# EAGLE board stm32 v0.9 (EAGLE 9.6.2), part 1 of 2
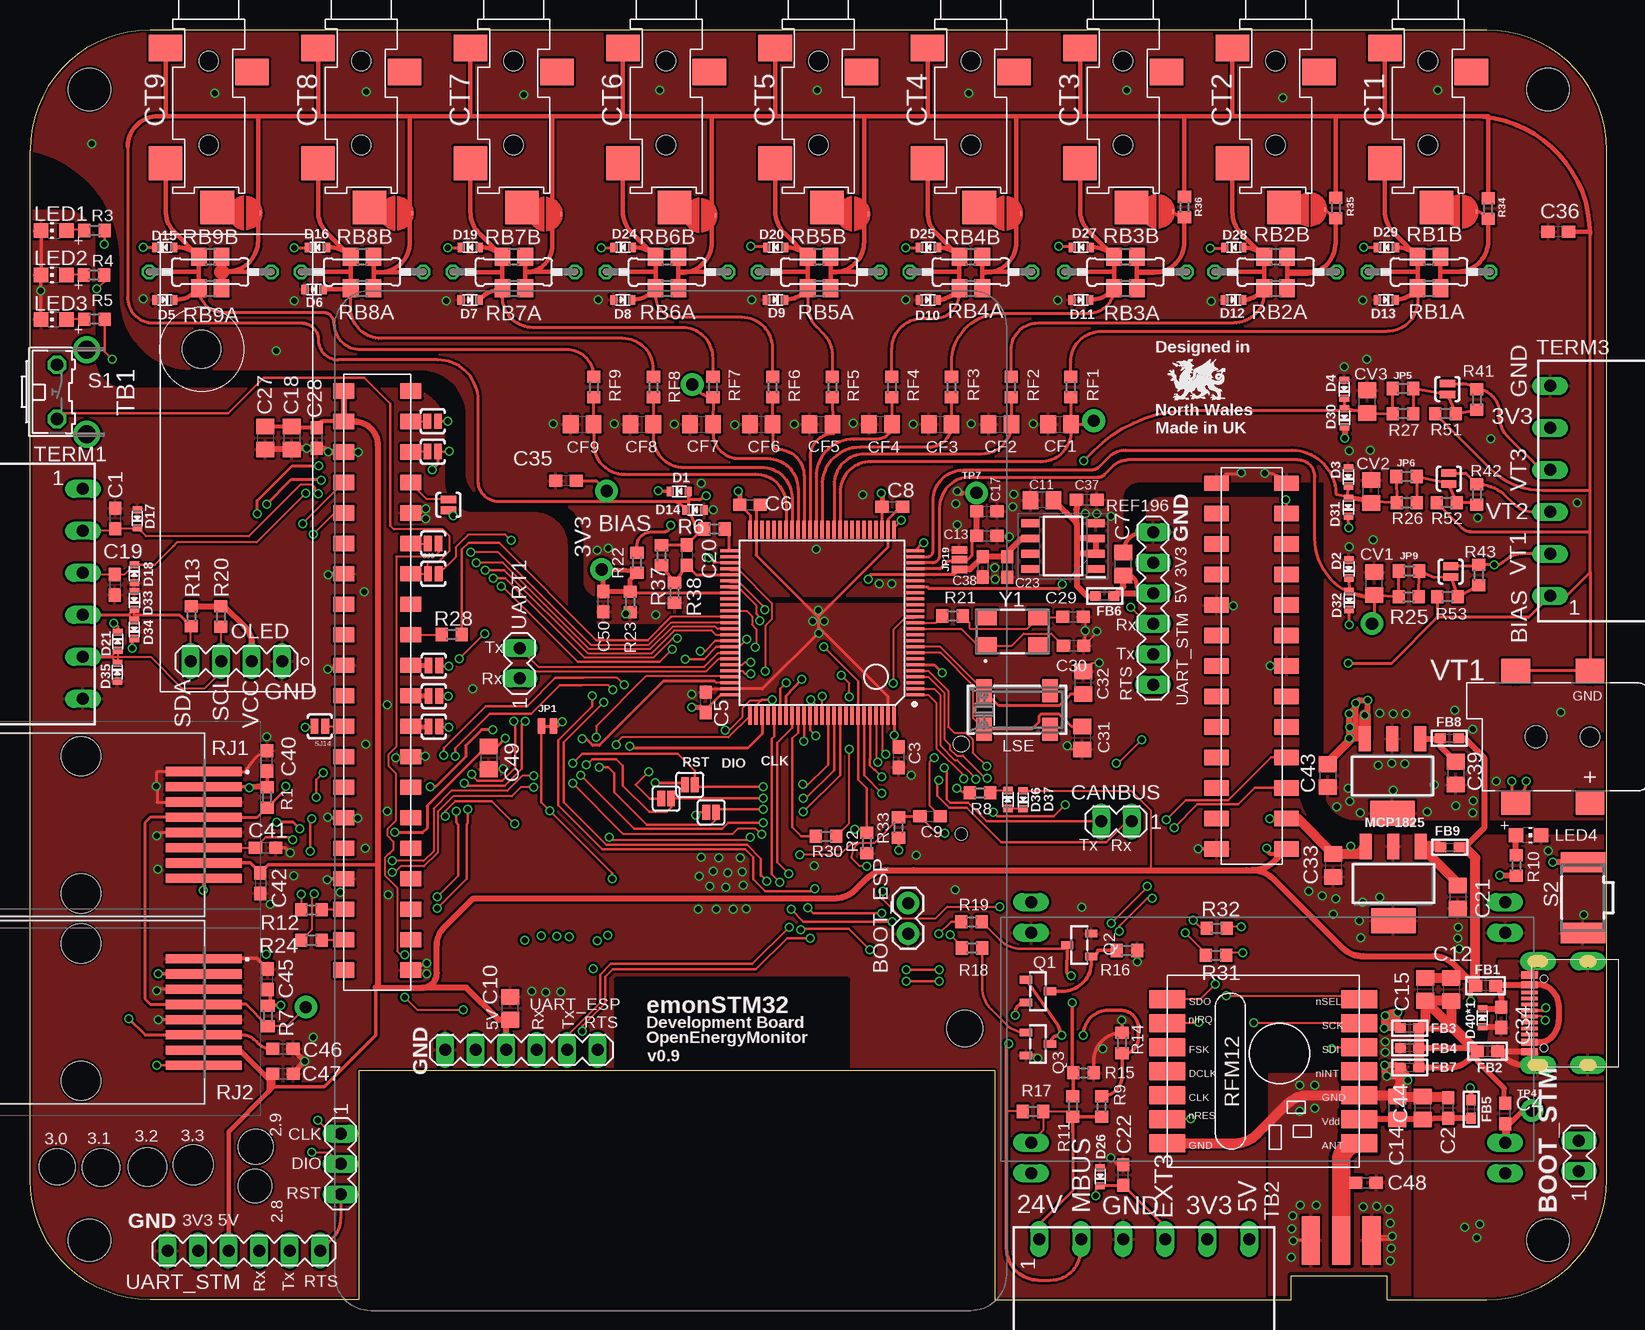
[diagram p5: board, top side]
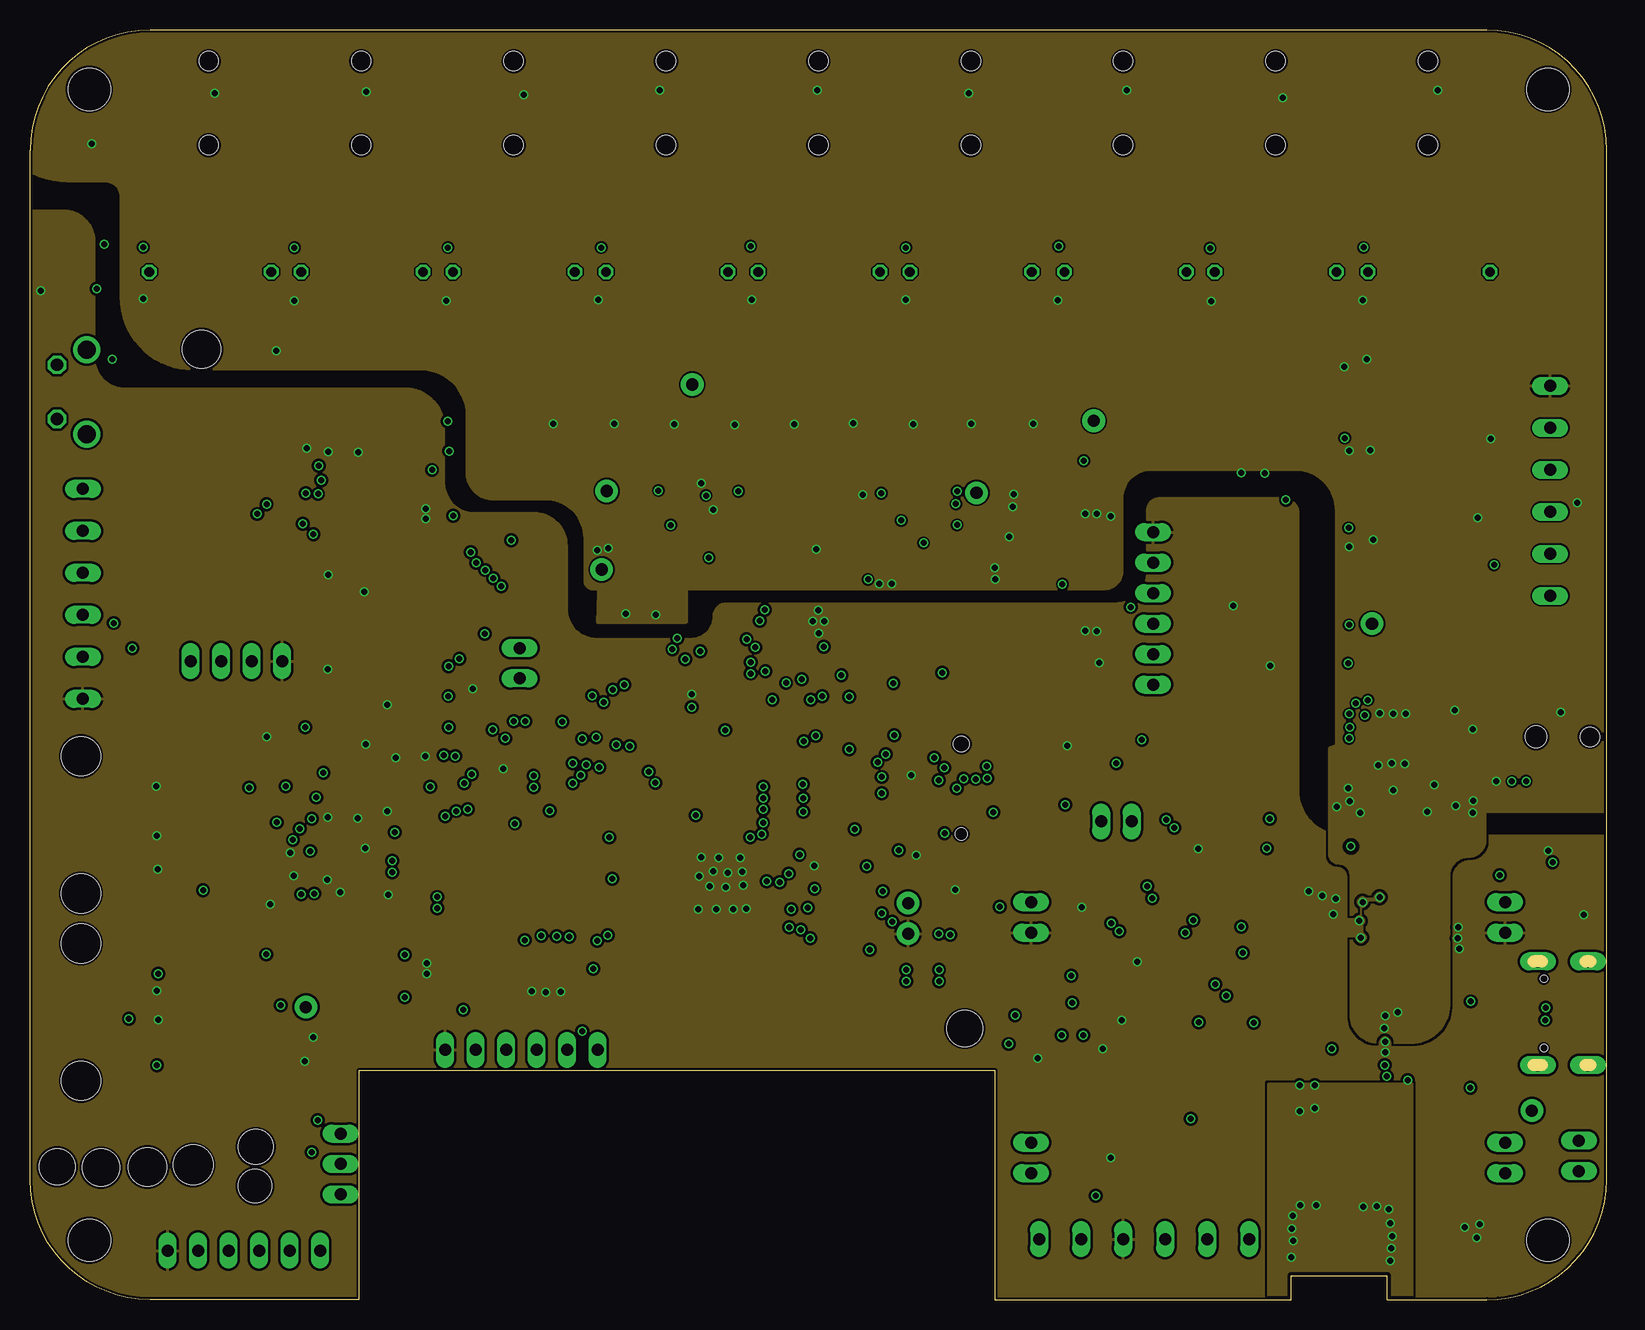
[diagram p6: board, inner layer GND]
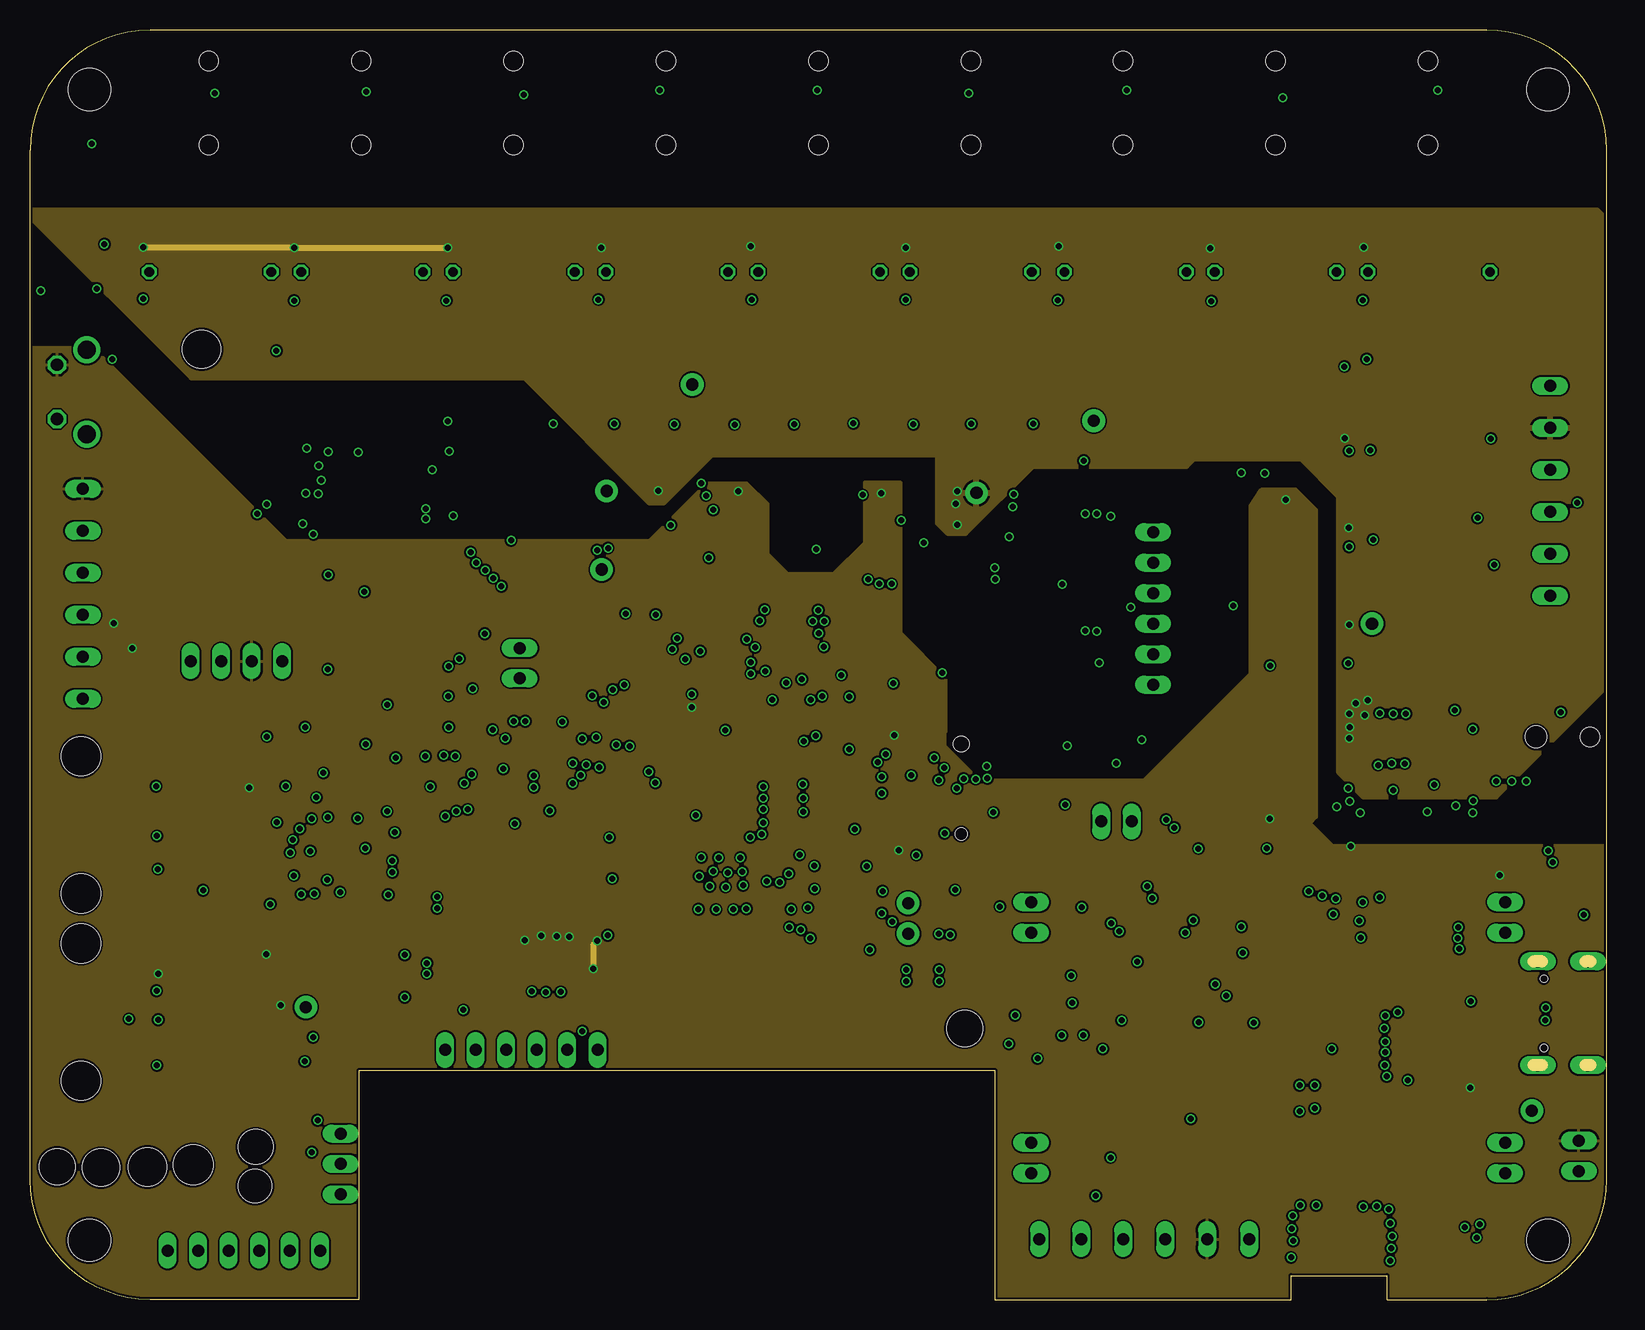
[diagram p7: board, inner layer +3V3]
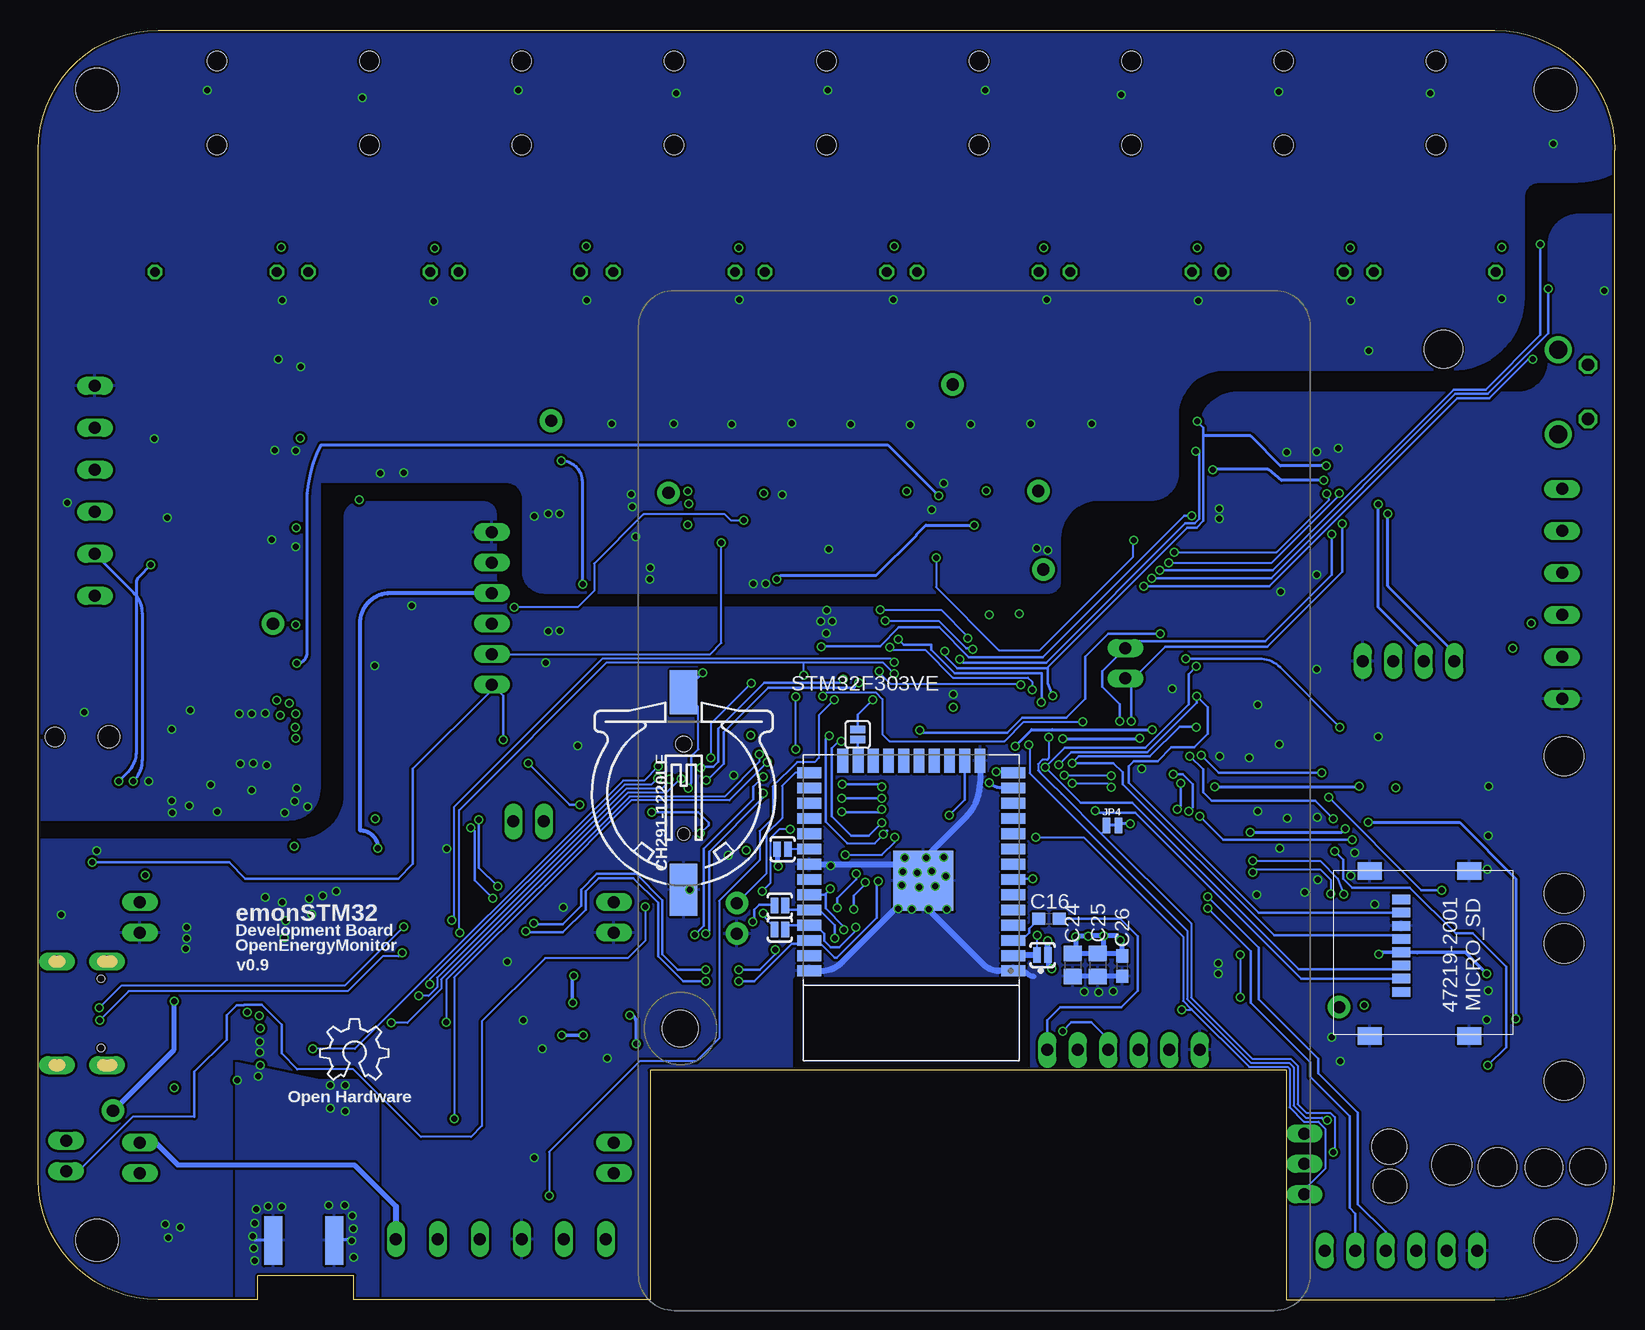
[diagram p8: board, bottom side, seen from below]

Size 131.4 x 105.8 mm. Coordinates in mm from the lower left corner, seen from the top.
Outline: 131.4,10 131.4,95.8 arc90 121.4,105.8 10,105.8 arc90 0,95.8 0,10 arc90 10,0 27.4,0 27.4,19.1 80.4,19.1 80.4,0 105.1,0 105.1,2 113.1,2 113.1,0 121.4,0 arc90 131.4,10
Copper layers (1+2*15+16): Top 0.035mm / dielectric 0.2mm / GND 0.018mm / dielectric 1.1mm / +3V3 0.018mm / dielectric 0.2mm / Bottom 0.035mm
Design rules "ragworm *": minimum track width 7mil, minimum drill 0.5mm, track to track 6mil, track to pad 6mil, pad to pad 7mil, via to via 8mil, smd to smd 0mil, copper to edge 8mil, drill to drill 10mil, minimum pad ring 3mil, minimum via ring 3mil, stop-mask expansion 2mil, vias tented up to drill 25mil, thermal gap 8mil
Net classes: 0 default: width 0.178 mm, drill 0.5 mm, clearance 0.152 mm; 1 power: width 0.254 mm, drill 0.5 mm, clearance 0.152 mm; 2 gnd: width 0.254 mm, drill 0.5 mm, clearance 0.152 mm; 3 ant: width 0.406 mm, drill 0.5 mm, clearance 0.254 mm; 4 cts_vts: width 0.254 mm, drill 0.5 mm, clearance 0.229 mm
Holes 3.5 mm at 126.5,100.85 4.95,100.85 4.95,4.95 126.5,4.95
Holes 3.18 mm at 14.3,79.2
Holes 3 mm at 2.27,11.06
Holes 3.1 mm at 5.92,11
Holes 3.2 mm at 9.79,11.06
Holes 3.3 mm at 13.6,11.23
Holes 2.9 mm at 18.82,12.72
Holes 2.8 mm at 18.75,9.46
tRestrict: area 48.8,18.3 to 68.2,26.7
bRestrict: area 49,18.3 to 68.3,26.7

## Footprints (pad centres in the part's own frame; a part is rotated, then mirrored left to right if it is on the bottom)
1X02 = drill 1.016 pad 1.88: 1 0,0; 2 2.54,0
MA02-1 = drill 1 long: 1 -2.54,0; 2 0,0
C0603 = smd 1.1 x 1: 1 -0.85,0; 2 0.85,0
C0805 = smd 1.3 x 1.5: 1 -0.95,0; 2 0.95,0
SJ-352X-SMT = smd 2.8 x 2.2: P$1 -3.6,-2.4; P$3 3.6,-4.4 | smd 2.8 x 2.8: P$2 -3.6,-12; P$4 0.7,-15.7 | hole 1.6: 0,-3.5; 0,-10.5
SOD-523 = smd 0.8 x 0.6: A 0,-0.75; K 0,0.75
2X13_SMT = smd 1.27 x 2.032: 1 -15.24,-2.921; 2 -15.24,2.921; 3 -12.7,-2.921; 4 -12.7,2.921; 5 -10.16,-2.921; 6 -10.16,2.921; 7 -7.62,-2.921; 8 -7.62,2.921; 9 -5.08,-2.921; 10 -5.08,2.921; 11 -2.54,-2.921; 12 -2.54,2.921; 13 0,-2.921; 14 0,2.921; 15 2.54,-2.921; 16 2.54,2.921; 17 5.08,-2.921; 18 5.08,2.921; 19 7.62,-2.921; 20 7.62,2.921; 21 10.16,-2.921; 22 10.16,2.921; 23 12.7,-2.921; 24 12.7,2.921; 25 15.24,-2.921; 26 15.24,2.921
0603 = smd 1.1 x 1: 1 -0.85,0; 2 0.85,0
_0603 = smd 0.9 x 0.8: 1 -0.762,0; 2 0.762,0
CH291-1220LF = smd 2.3 x 3.66: + 0,-2.296 | smd 2.3 x 4.3: - 0,14.146 | hole 1.3: 0,2 | hole 1: 0,9.5
SJ_2S-NO = smd 0.635 x 1.27: 1 -0.45,0; 2 0.45,0
SMA-EDGE = smd 1.524 x 4.064: GND@0 0,0; GND@1 5.08,0; SIG 2.54,0 | smd 1.524 x 4.064 bottom: GND@2 0,0; GND@3 5.08,0
SMT-JUMPER_2_NC_TRACE_NO-SILK = smd 0.635 x 1.27: 1 -0.508,0; 2 0.508,0
R0603 = smd 1 x 1.1: 1 -0.85,0; 2 0.85,0
SMT-JUMPER_2_NO_NO-SILK_ROUND = smd 0.152 x 0.305: 1 -1.27,0; 2 1.27,0
SMT-JUMPER_3_NO_NO-SILK = smd 0.635 x 1.27: 1 -0.813,0; 2 0,0; 3 0.813,0
CHIP-LED0805 = smd 1.2 x 1.2: A 0,-1.05; C 0,1.05
CRYSTAL_8X3.8 = smd 1.3 x 1.9: P$1 -2.75,-1.6; P$2 2.75,-1.6; P$3 2.75,1.6; P$4 -2.75,1.6
SOT-223 = smd 1 x 2.1: 1 -2.3,-3.1; 2 0,-3.1; 3 2.3,-3.1 | smd 3.7 x 2.1: 4 0,3.1
MA04-1-OLED = drill 1 long: 1 -3.81,0; 2 -1.27,0; 3 1.27,0; 4 3.81,0
RPI3MIRROR2 = smd 1.27 x 1.778: P$41 8.371,6.351; P$42 8.371,0.763; P$43 10.911,6.351; P$44 10.911,0.763; P$45 13.451,6.351; P$46 13.451,0.763; P$47 15.991,6.351; P$48 15.991,0.763; P$49 18.531,6.351; P$50 18.531,0.763; P$51 21.071,6.351; P$52 21.071,0.763; P$53 23.611,6.351; P$54 23.611,0.763; P$55 26.151,6.351; P$56 26.151,0.763; P$57 28.691,6.351; P$58 28.691,0.763; P$59 31.231,6.351; P$60 31.231,0.763; P$61 33.771,6.351; P$62 33.771,0.763; P$63 36.311,6.351; P$64 36.311,0.763; P$65 38.851,6.351; P$66 38.851,0.763; P$67 41.391,6.351; P$68 41.391,0.763; P$69 43.931,6.351; P$70 43.931,0.763; P$71 46.471,6.351; P$72 46.471,0.763; P$73 49.011,6.351; P$74 49.011,0.763; P$75 51.551,6.351; P$76 51.551,0.763; P$77 54.091,6.351; P$78 54.091,0.763; P$79 56.631,6.351; P$80 56.631,0.763 | hole 3: 61.5,52.505
SOIC127P599X175-8N = smd 1.526 x 0.65: 1 -2.712,1.905; 2 -2.712,0.635; 3 -2.712,-0.635; 4 -2.712,-1.905; 5 2.712,-1.905; 6 2.712,-0.635; 7 2.712,0.635; 8 2.712,1.905
SOT23-R = smd 0.635 x 1.016: 1 -0.95,-1; 2 0.95,-1; 3 0,1
0207/10 = drill 0.813 octagon: 1 -5.08,0; 2 5.08,0
R0805 = smd 1.3 x 1.5: 1 -0.95,0; 2 0.95,0
RFM12 = smd 1.5 x 3: 1 -5,-10; 2 -3,-10; 3 -1,-10; 4 1,-10; 5 3,-10; 6 5,-10; 7 7,-10; 8 7,6; 9 5,6; 10 3,6; 11 1,6; 12 -1,6; 13 -3,6; 14 -5,6
955016889 = smd 0.76 x 6.35: 1 -4.445,8.975; 2 -3.175,8.975; 3 -1.905,8.975; 4 -0.635,8.975; 5 0.635,8.975; 6 1.905,8.975; 7 3.175,8.975; 8 4.445,8.975 | hole 3.25: -5.715,-1.25; 5.715,-1.25
B3F-31XX = drill 1.016 octagon: 1 -2.261,-1.245; 2 2.261,-1.245 | drill 1.499 pad 2.159: 3 -3.505,1.245; 4 3.505,1.245
KSS = smd 1.7 x 3.7: 1 -2.95,0; 2 2.95,0
SMT-JUMPER_2_NO_SILK = smd 0.635 x 1.27: 1 -0.406,0; 2 0.406,0
TQFP100 = smd 0.27 x 1.5: 1 -6,-7.75; 2 -5.5,-7.75; 3 -5,-7.75; 4 -4.5,-7.75; 5 -4,-7.75; 6 -3.5,-7.75; 7 -3,-7.75; 8 -2.5,-7.75; 9 -2,-7.75; 10 -1.5,-7.75; 11 -1,-7.75; 12 -0.5,-7.75; 13 0,-7.75; 14 0.5,-7.75; 15 1,-7.75; 16 1.5,-7.75; 17 2,-7.75; 18 2.5,-7.75; 19 3,-7.75; 20 3.5,-7.75; 21 4,-7.75; 22 4.5,-7.75; 23 5,-7.75; 24 5.5,-7.75; 25 6,-7.75; 51 6,7.75; 52 5.5,7.75; 53 5,7.75; 54 4.5,7.75; 55 4,7.75; 56 3.5,7.75; 57 3,7.75; 58 2.5,7.75; 59 2,7.75; 60 1.5,7.75; 61 1,7.75; 62 0.5,7.75; 63 0,7.75; 64 -0.5,7.75; 65 -1,7.75; 66 -1.5,7.75; 67 -2,7.75; 68 -2.5,7.75; 69 -3,7.75; 70 -3.5,7.75; 71 -4,7.75; 72 -4.5,7.75; 73 -5,7.75; 74 -5.5,7.75; 75 -6,7.75 | smd 1.5 x 0.27: 26 7.75,-6; 27 7.75,-5.5; 28 7.75,-5; 29 7.75,-4.5; 30 7.75,-4; 31 7.75,-3.5; 32 7.75,-3; 33 7.75,-2.5; 34 7.75,-2; 35 7.75,-1.5; 36 7.75,-1; 37 7.75,-0.5; 38 7.75,0; 39 7.75,0.5; 40 7.75,1; 41 7.75,1.5; 42 7.75,2; 43 7.75,2.5; 44 7.75,3; 45 7.75,3.5; 46 7.75,4; 47 7.75,4.5; 48 7.75,5; 49 7.75,5.5; 50 7.75,6; 76 -7.75,6; 77 -7.75,5.5; 78 -7.75,5; 79 -7.75,4.5; 80 -7.75,4; 81 -7.75,3.5; 82 -7.75,3; 83 -7.75,2.5; 84 -7.75,2; 85 -7.75,1.5; 86 -7.75,1; 87 -7.75,0.5; 88 -7.75,0; 89 -7.75,-0.5; 90 -7.75,-1; 91 -7.75,-1.5; 92 -7.75,-2; 93 -7.75,-2.5; 94 -7.75,-3; 95 -7.75,-3.5; 96 -7.75,-4; 97 -7.75,-4.5; 98 -7.75,-5; 99 -7.75,-5.5; 100 -7.75,-6
MA06-1 = drill 1 long: 1 -6.35,0; 2 -3.81,0; 3 -1.27,0; 4 1.27,0; 5 3.81,0; 6 6.35,0
MA03-1 = drill 1 long: 1 -2.54,0; 2 0,0; 3 2.54,0
3.5MM_X6 = drill 1 long: P$1 3,8.75; P$2 3,5.25; P$3 3,1.75; P$4 3,-1.75; P$5 3,-5.25; P$6 3,-8.75
1X01_NO_SILK = drill 1.016 pad 1.88: 1 0,0
MODULE_ESP32-WROOM-32D = smd 2 x 0.9: 1 -8.5,5.26; 2 -8.5,3.99; 3 -8.5,2.72; 4 -8.5,1.45; 5 -8.5,0.18; 6 -8.5,-1.09; 7 -8.5,-2.36; 8 -8.5,-3.63; 9 -8.5,-4.9; 10 -8.5,-6.17; 11 -8.5,-7.44; 12 -8.5,-8.71; 13 -8.5,-9.98; 14 -8.5,-11.25; 25 8.5,-11.25; 26 8.5,-9.98; 27 8.5,-8.71; 28 8.5,-7.44; 29 8.5,-6.17; 30 8.5,-4.9; 31 8.5,-3.63; 32 8.5,-2.36; 33 8.5,-1.09; 34 8.5,0.18; 35 8.5,1.45; 36 8.5,2.72; 37 8.5,3.99; 38 8.5,5.26 | smd 0.9 x 2: 15 -5.715,-12.25; 16 -4.445,-12.25; 17 -3.175,-12.25; 18 -1.905,-12.25; 19 -0.635,-12.25; 20 0.635,-12.25; 21 1.905,-12.25; 22 3.175,-12.25; 23 4.445,-12.25; 24 5.715,-12.25 | smd 5 x 5: 39 -1,-2.24
BOOST = drill 1 long: IN+ 17.5,39.5; IN+1 20.04,39.5; OUT+ 17.5,0; OUT+1 20.04,0; P$1 0,0; P$2 0,39.5; P$3 -2.54,0; P$4 -2.54,39.5
47219-2001_MICROSD = smd 1.45 x 2: P$1 0,0; P$2 13.75,0; P$3 0,8.3; P$4 13.75,8.3 | smd 0.8 x 1.5: PIN1 10.08,2.6; PIN2 8.98,2.6; PIN3 7.88,2.6; PIN4 6.78,2.6; PIN5 5.68,2.6; PIN6 4.58,2.6; PIN7 3.48,2.6; PIN8 2.38,2.6
USB-C = smd 0.6 x 1.4: A1/B12 -3.2,0.7; A4/B9 -2.4,0.7; B1/A12 3.2,0.7; B4/A9 2.4,0.7 | smd 0.3 x 1.4: A5 -1.25,0.7; A6 -0.25,0.7; A7 0.25,0.7; A8 1.25,0.7; B5 1.75,0.7; B6 0.75,0.7; B7 -0.75,0.7; B8 -1.75,0.7 | drill 1 pad 1.2 long: GND1 -4.32,0; GND2 4.33,0; GND3 4.33,-4.18; GND4 -4.32,-4.18 | hole 0.6: -2.89,-0.5; 2.89,-0.5
DCJACK_2MM_SMT = smd 2.4 x 2: GND 0,-5.5; GNDBREAK 6.2,-5.5; PWR1 0,5.5; PWR2 6.2,5.5 | hole 1.6: 0,0 | hole 1.8: 4.5,0
ABMM2 = smd 1.8 x 1.4: 1 -2.2,-1.2; 2 2.2,-1.2; 3 2.2,1.2; 4 -2.2,1.2

## Placement (x,y rotation side)
BOOT_ESP  [1X02]  73.18,30.5 90 top
BOOT_STM  [MA02-1]  129.07,13.25 90 top
C1  100nF  [C0603]  7.12,65.08 90 top
C2  100nF  [C0603]  118.19,15.97 90 top
C3  100nF  [C0603]  72.38,45.2 270 top
C4  100nF  [C0603]  122.93,15.5 90 top
C5  100nF  [C0603]  56.33,49.77 90 top
C6  100nF  [C0603]  60,66.23 0 top
C7  2.2uF  [C0805]  91.12,61.3 90 top
C8  100nF  [C0603]  71.86,66.07 0 top
C9  1uF  [C0603]  75.02,40.27 0 top
C10  2.2uF  [C0805]  40.03,24.27 90 top
C11  22uF  [C0805]  84.33,66.63 180 top
C12  22uF  [C0805]  118.45,25.84 270 top
C13  2.2uF  [C0603]  79.73,63.65 0 top
C14  22uF  [C0805]  113.92,15.97 90 top
C15  2.2uF  [C0805]  116.25,25.85 270 top
C16  100nF  [C0603]  47.17,31.73 180 bottom
C17  100nF  [C0603]  79.74,65.69 0 top
C18  22uF  [C0805]  21.8,71.8 270 top
C19  100nF  [C0603]  7.08,59.57 270 top
C20  2.2uF  [C0603]  54.74,62.04 270 top
C21  22uF  [C0805]  118.98,33.55 270 top
C22  100nF  [C0603]  91.11,10.38 90 top
C23  1uf  [C0603]  81.44,61.06 270 top
C24  2.2uF  [C0805]  45.19,27.88 270 bottom
C25  2.2uF  [C0805]  43.1,27.88 270 bottom
C26  100nF  [C0603]  41.08,27.79 270 bottom
C27  2.2uF  [C0805]  19.6,71.8 270 top
C28  100nF  [C0603]  23.9,71.8 270 top
C29  15pF  [C0603]  86.92,56.91 0 top
C30  15pF  [C0603]  86.97,54.5 0 top
C31  10pF  [C0805]  87.68,46.79 270 top
C32  10pF  [C0805]  87.77,51.41 90 top
C33  22uF  [C0805]  108.61,36.18 270 top
C34  100nF  [C0603]  122.61,23.52 270 top
C35  1uF  [C0603]  44.67,68.25 180 top
C36  1uF  [C0603]  127.36,88.98 180 top
C37  100nF  [C0603]  88.06,66.67 0 top
C38  100nF  [C0603]  79.38,61.06 270 top
C39  22uF  [C0805]  118.81,43.87 270 top
C40  100nF  [C0603]  19.75,44.9 90 top
C41  100nF  [C0603]  19.64,37.67 0 top
C42  100nF  [C0603]  19.2,34.7 270 top
C43  22uF  [C0805]  108.15,43.66 270 top
C44  22uF  [C0805]  116.08,15.97 90 top
C45  100nF  [C0603]  19.8,26.7 90 top
C46  100nF  [C0603]  21.07,20.89 0 top
C47  100nF  [C0603]  21.08,18.84 0 top
C48  100nF  [C0603]  111.32,9.72 0 top
C49  10pF  [C0805]  38.22,45.15 270 top
C50  [C0603]  47.79,58.16 90 top
CANBUS  TX/RX  [MA02-1]  89.26,39.85 180 top
CF1  10nF  [C0805]  85.8,72.95 0 top
CF2  10nF  [C0805]  80.83,72.95 0 top
CF3  10nF  [C0805]  75.86,72.95 0 top
CF4  10nF  [C0805]  70.88,72.95 0 top
CF5  10nF  [C0805]  65.91,72.95 0 top
CF6  10nF  [C0805]  60.94,72.95 0 top
CF7  10nF  [C0805]  55.96,72.95 0 top
CF8  10nF  [C0805]  50.99,72.95 0 top
CF9  10nF  [C0805]  46.02,72.95 0 top
CT1  SJ-3523-SMT  [SJ-352X-SMT]  116.5,106.7 0 top
CT2  SJ-3523-SMT  [SJ-352X-SMT]  103.8,106.7 0 top
CT3  SJ-3523-SMT  [SJ-352X-SMT]  91.1,106.7 0 top
CT4  SJ-3523-SMT  [SJ-352X-SMT]  78.4,106.7 0 top
CT5  SJ-3523-SMT  [SJ-352X-SMT]  65.7,106.7 0 top
CT6  SJ-3523-SMT  [SJ-352X-SMT]  53,106.7 0 top
CT7  SJ-3523-SMT  [SJ-352X-SMT]  40.3,106.7 0 top
CT8  SJ-3523-SMT  [SJ-352X-SMT]  27.6,106.7 0 top
CT9  SJ-3523-SMT  [SJ-352X-SMT]  14.9,106.7 0 top
CV1  10nF  [C0805]  112.03,59.68 90 top
CV2  10nF  [C0805]  111.75,67.34 90 top
CV3  10nF  [C0805]  111.43,74.83 90 top
D1  ESD5Z3.3T1G  [SOD-523]  54.1,67.35 90 top
D2  ESD5Z3.3T1G  [SOD-523]  109.92,60.88 180 top
D3  ESD5Z3.3T1G  [SOD-523]  109.87,68.55 180 top
D4  ESD5Z3.3T1G  [SOD-523]  109.52,75.86 180 top
D5  ESD5Z3.3T1G  [SOD-523]  11.23,83.31 270 top
D6  ESD5Z3.3T1G  [SOD-523]  23.66,84.18 270 top
D7  ESD5Z3.3T1G  [SOD-523]  36.67,83.31 270 top
D8  ESD5Z3.3T1G  [SOD-523]  49.4,83.31 270 top
D9  ESD5Z3.3T1G  [SOD-523]  62.12,83.31 270 top
D10  ESD5Z3.3T1G  [SOD-523]  74.84,83.31 270 top
D11  ESD5Z3.3T1G  [SOD-523]  87.57,83.31 270 top
D12  ESD5Z3.3T1G  [SOD-523]  100.29,83.31 270 top
D13  ESD5Z3.3T1G  [SOD-523]  113.01,83.31 270 top
D14  ESD5Z3.3T1G  [SOD-523]  55.42,65.8 90 top
D15  ESD5Z3.3T1G  [SOD-523]  11.23,87.69 90 top
D16  ESD5Z3.3T1G  [SOD-523]  23.96,87.69 90 top
D17  ESD5Z3.3T1G  [SOD-523]  8.95,65.08 180 top
D18  ESD5Z3.3T1G  [SOD-523]  8.69,60.5 0 top
D19  ESD5Z3.3T1G  [SOD-523]  36.69,87.69 90 top
D20  ESD5Z3.3T1G  [SOD-523]  62.14,87.69 90 top
D21  ESD5Z3.3T1G  [SOD-523]  8.69,55.84 180 top
D24  ESD5Z3.3T1G  [SOD-523]  49.41,87.69 90 top
D25  ESD5Z3.3T1G  [SOD-523]  74.87,87.69 90 top
D26  ESD5Z3.3T1G  [SOD-523]  89.18,10.25 180 top
D27  ESD5Z3.3T1G  [SOD-523]  87.59,87.69 90 top
D28  ESD5Z3.3T1G  [SOD-523]  100.32,87.69 90 top
D29  ESD5Z3.3T1G  [SOD-523]  113.05,87.69 90 top
D30  ESD5Z3.3T1G  [SOD-523]  109.54,73.49 180 top
D31  ESD5Z3.3T1G  [SOD-523]  109.87,66.03 180 top
D32  ESD5Z3.3T1G  [SOD-523]  109.93,58.25 180 top
D33  ESD5Z3.3T1G  [SOD-523]  8.71,58.27 180 top
D34  ESD5Z3.3T1G  [SOD-523]  7.32,54.85 0 top
D35  ESD5Z3.3T1G  [SOD-523]  7.28,52.28 0 top
D36  ESD5Z3.3T1G  [SOD-523]  82.76,41.65 180 top
D37  ESD5Z3.3T1G  [SOD-523]  81.5,41.67 0 top
D40*1  ESD5Z5.0T1G  [SOD-523]  121.03,23.48 0 top
EXPANSION  TSM-113-01-T-DV  [2X13_SMT]  101.8,52.8 270 top
FB1  [0603]  121.31,26.16 180 top
FB2  [0603]  121.46,20.68 180 top
FB3  [_0603]  114.97,22.62 180 top
FB4  [_0603]  114.97,20.98 180 top
FB5  [_0603]  120.1,15.87 90 top
FB6  [_0603]  89.56,58.63 0 top
FB7  [_0603]  114.97,19.34 180 top
FB8  [_0603]  118.29,46.78 0 top
FB9  [_0603]  118.32,37.7 0 top
G1  CH291-1220LF  [CH291-1220LF]  77.61,48.3 180 bottom
J1  SOLDERJUMPERNO  [SJ_2S-NO]  34.87,66.23 90 top
J$1  SMA_EDGE  [SMA-EDGE]  106.72,4.93 0 top
JP1  JUMPER-SMT_2_NC_TRACE_NO-SILK  [SMT-JUMPER_2_NC_TRACE_NO-SILK]  43.13,47.8 0 top
JP4  JUMPER-SMT_2_NC_TRACE_NO-SILK  [SMT-JUMPER_2_NC_TRACE_NO-SILK]  41.87,39.52 180 bottom
JP5  0R  [R0603]  114.4,75.93 0 top
JP6  0R  [R0603]  114.72,68.59 0 top
JP9  0R  [R0603]  114.93,60.72 0 top
JP10  JUMPER-SMT_2_NO_NO-SILK_ROUND  [SMT-JUMPER_2_NO_NO-SILK_ROUND]  119.28,90.67 180 top
JP11  JUMPER-SMT_2_NO_NO-SILK_ROUND  [SMT-JUMPER_2_NO_NO-SILK_ROUND]  81.31,90.52 180 top
JP12  JUMPER-SMT_2_NO_NO-SILK_ROUND  [SMT-JUMPER_2_NO_NO-SILK_ROUND]  106.66,90.85 180 top
JP13  JUMPER-SMT_2_NO_NO-SILK_ROUND  [SMT-JUMPER_2_NO_NO-SILK_ROUND]  68.6,90.48 180 top
JP14  JUMPER-SMT_2_NO_NO-SILK_ROUND  [SMT-JUMPER_2_NO_NO-SILK_ROUND]  93.98,90.68 180 top
JP15  JUMPER-SMT_2_NO_NO-SILK_ROUND  [SMT-JUMPER_2_NO_NO-SILK_ROUND]  55.87,90.37 180 top
JP16  JUMPER-SMT_2_NO_NO-SILK_ROUND  [SMT-JUMPER_2_NO_NO-SILK_ROUND]  17.94,90.55 180 top
JP17  JUMPER-SMT_2_NO_NO-SILK_ROUND  [SMT-JUMPER_2_NO_NO-SILK_ROUND]  30.55,90.53 180 top
JP18  JUMPER-SMT_2_NO_NO-SILK_ROUND  [SMT-JUMPER_2_NO_NO-SILK_ROUND]  42.97,90.46 180 top
JP19  JUMPER-SMT_3_NO_NO-SILK  [SMT-JUMPER_3_NO_NO-SILK]  77.46,61.66 270 top
LED1  Green 1.85V  [CHIP-LED0805]  1.98,89.08 90 top
LED2  Orange 1.85V  [CHIP-LED0805]  1.98,85.38 90 top
LED3  Red 1.85V  [CHIP-LED0805]  1.98,81.68 90 top
LED4  Green 1.85V  [CHIP-LED0805]  124.88,38.69 270 top
LOGO1  OSHW_LOGO_6MILX0200-NT  [OSHW_6X200_NOTEXT]  107.87,18.31 0 bottom
LSE  32.768kHz  [CRYSTAL_8X3.8]  82.26,49.13 0 top
MCP1825  MCP1825SOT-223-3  [SOT-223]  113.61,34.66 180 top
MCP1825(ANALOG)  MCP1825SOT-223-3  [SOT-223]  113.53,43.64 180 top
OLED  [MA04-1-OLED]  17.2,53.2 0 top
PCB2  RPI3YA  [RPI3MIRROR2]  25.38,84.09 270 top
PS1  LT1461AIS8-3.3#PBF  [SOIC127P599X175-8N]  86.09,62.8 180 top
Q1  [SOT23-R]  84,25.7 270 top
Q2  [SOT23-R]  87.44,29.55 90 top
Q3  [SOT23-R]  84,21.3 270 top
R1  4.7k  [R0603]  19.75,41.85 90 top
R2  10k  [R0603]  69.73,38.04 270 top
R3  330R  [R0603]  5.38,89.08 0 top
R4  330R  [R0603]  5.33,85.38 0 top
R5  330R  [R0603]  5.37,81.71 0 top
R6  0R  [R0603]  57.03,64.22 0 top
R7  4.7k  [R0603]  19.83,23.65 90 top
R8  100k  [R0603]  79.16,42.23 180 top
R9  39K  [R0603]  89.3,16.1 270 top
R10  330R  [R0603]  123.86,36.18 270 top
R11  33K  [R0603]  86.9,16.1 270 top
R12  10K  [R0603]  23.46,32.48 180 top
R13  10k  [R0603]  13.44,56.95 90 top
R14  22K  [R0603]  91,21.4 270 top
R15  3k3  [R0603]  87.8,18.9 180 top
R16  82R  [R0603]  91.4,29.1 180 top
R17  220K  [R0603]  83.58,15.68 0 top
R18  1k  [R0603]  78.5,29.3 180 top
R19  1k  [R0603]  78.46,31.48 180 top
R20  10k  [R0603]  15.9,56.91 90 top
R21  2k  [R0603]  76.88,56.96 0 top
R22  10k  [R0603]  50.58,61.4 90 top
R23  10k  [R0603]  50.02,58.12 90 top
R24  10K  [R0603]  23.45,29.95 180 top
R25  9k1  [R0603]  114.9,58.57 180 top
R26  9k1  [R0603]  114.73,66.4 180 top
R27  9k1  [R0603]  114.42,73.83 180 top
R28  10K  [R0603]  35.15,55.43 180 top
R30  1k5  [R0603]  66.34,38.61 180 top
R31  20R  [R0603]  98.83,28.69 180 top
R32  20R  [R0603]  98.9,30.94 180 top
R33  10k  [R0603]  72.37,39.34 90 top
R34  0R  [R0603]  121.51,90.92 90 top
R35  0R  [R0603]  108.82,90.98 90 top
R36  0R  [R0603]  96.2,91.05 90 top
R37  0R  [R0603]  52.62,62.03 270 top
R38  1k  [R0603]  53.71,58.91 270 top
R41  100k  [R0603]  120.57,75 270 top
R42  100k  [R0603]  120.57,67.11 90 top
R43  100k  [R0603]  120.73,60.37 90 top
R51  10k  [R0603]  117.97,73.83 180 top
R52  10k  [R0603]  118.06,66.42 180 top
R53  10k  [R0603]  118.14,58.58 180 top
RB1_  22r 0.5W  [0207/10]  116.59,85.64 0 top
RB1A  22r 0.3W 1%  [R0805]  116.59,84.27 0 top
RB1B  22r 0.3W 1%  [R0805]  116.59,86.92 0 top
RB2_  22r  [0207/10]  103.8,85.64 0 top
RB2A  22r  [R0805]  103.8,84.27 0 top
RB2B  22r  [R0805]  103.8,86.92 0 top
RB3_  22r  [0207/10]  91.3,85.64 0 top
RB3A  22r  [R0805]  91.3,84.27 0 top
RB3B  22r  [R0805]  91.3,86.92 0 top
RB4_  22r  [0207/10]  78.4,85.64 0 top
RB4A  22r  [R0805]  78.4,84.27 0 top
RB4B  22r  [R0805]  78.4,86.92 0 top
RB5_  22r  [0207/10]  65.76,85.64 0 top
RB5A  22r  [R0805]  65.76,84.27 0 top
RB5B  22r  [R0805]  65.76,86.92 0 top
RB6_  22r  [0207/10]  53.09,85.64 0 top
RB6A  22r  [R0805]  53.09,84.27 0 top
RB6B  22r  [R0805]  53.09,86.92 0 top
RB7_  22r  [0207/10]  40.32,85.64 0 top
RB7A  22r  [R0805]  40.32,84.27 0 top
RB7B  22r  [R0805]  40.32,86.92 0 top
RB8_  22r  [0207/10]  27.68,85.64 0 top
RB8A  22r  [R0805]  27.68,84.27 0 top
RB8B  22r  [R0805]  27.68,86.92 0 top
RB9_  100R 0.1%  [0207/10]  15.02,85.64 0 top
RB9A  100R 0.1%  [R0805]  15.02,84.27 0 top
RB9B  100R 0.1%  [R0805]  15.02,86.92 0 top
RF1  9k1 0.1%  [R0603]  86.73,76.04 270 top
RF2  9k1 0.1%  [R0603]  81.76,76.04 270 top
RF3  9k1 0.1%  [R0603]  76.79,76.04 270 top
RF4  9k1 0.1%  [R0603]  71.82,76.04 270 top
RF5  9k1 0.1%  [R0603]  66.86,76.04 270 top
RF6  9k1 0.1%  [R0603]  61.89,76.04 270 top
RF7  9k1 0.1%  [R0603]  56.92,76.04 270 top
RF8  9k1 0.1%  [R0603]  51.95,76.04 270 top
RF9  9k1 0.1%  [R0603]  46.98,76.04 270 top
RFM69HCW  RFM12_SMDSMD  [RFM12]  104.78,20.03 270 top
RJ1  95501-6889  [955016889]  5.5,39.56 270 top
RJ2  95501-6889  [955016889]  5.5,23.96 270 top
S1  [B3F-31XX]  3.5,75.64 270 top
S2  KSS221GLFS  [KSS]  129.4,33.5 90 top
SJ3  SOLDERJUMPERNO  [SJ_2S-NO]  33.61,60.48 0 top
SJ4  JUMPER-SMT_2_NO_SILK  [SMT-JUMPER_2_NO_SILK]  53.01,41.75 0 top
SJ5  SOLDERJUMPERNO  [SJ_2S-NO]  33.66,52.83 180 top
SJ6  SOLDERJUMPERNO  [SJ_2S-NO]  33.66,50.29 180 top
SJ7  SOLDERJUMPERNO  [SJ_2S-NO]  33.66,47.75 180 top
SJ9  JUMPER-SMT_2_NO_SILK  [SMT-JUMPER_2_NO_SILK]  56.76,40.61 0 top
SJ10  JUMPER-SMT_2_NO_SILK  [SMT-JUMPER_2_NO_SILK]  54.98,42.9 0 top
SJ13  JUMPER-SMT_2_NO_SILK  [SMT-JUMPER_2_NO_SILK]  63.1,47.09 90 bottom
SJ14  SOLDERJUMPERNO  [SJ_2S-NO]  24.16,47.78 180 top
SJ20  SOLDERJUMPERNO  [SJ_2S-NO]  69.59,30.84 0 bottom
SJ21  SOLDERJUMPERNO  [SJ_2S-NO]  69.59,32.84 0 bottom
SJ23  SOLDERJUMPERNO  [SJ_2S-NO]  47.7,28.72 0 bottom
SJ25  SOLDERJUMPERNO  [SJ_2S-NO]  69.36,37.54 180 bottom
SJ26  SOLDERJUMPERNO  [SJ_2S-NO]  33.56,73.2 180 top
SJ27  SOLDERJUMPERNO  [SJ_2S-NO]  33.56,70.67 0 top
SJ32  SOLDERJUMPERNO  [SJ_2S-NO]  33.6,63.01 180 top
SJ35  SOLDERJUMPERNO  [SJ_2S-NO]  118.12,75.88 90 top
SJ36  SOLDERJUMPERNO  [SJ_2S-NO]  118.24,68.42 90 top
SJ37  SOLDERJUMPERNO  [SJ_2S-NO]  118.39,60.67 90 top
STM32F303VE  STM32F303VE  [TQFP100]  66,56.4 90 top
SV1  [MA06-1]  93.6,57.6 270 top
SV2  [MA06-1]  40.95,20.81 0 top
SV3  [MA03-1]  25.88,11.3 270 top
TB2  3.5MM_TB_X6  [3.5MM_X6]  92.84,2.03 90 top
TERM1  3.5MM_TB_X6  [3.5MM_X6]  1.4,58.8 0 top
TERM3  3.5MM_TB_X6  [3.5MM_X6]  129.67,67.39 180 top
TP4  TEST-POINTPOGO_PTH  [1X01_NO_SILK]  125.16,15.75 0 top
TP5  TEST-POINTPOGO_PTH  [1X01_NO_SILK]  48.06,67.38 0 top
TP7  TEST-POINTPOGO_PTH  [1X01_NO_SILK]  78.87,67.23 0 top
TP9  TEST-POINTPOGO_PTH  [1X01_NO_SILK]  22.98,24.37 0 top
TP10  TEST-POINTPOGO_PTH  [1X01_NO_SILK]  47.64,60.84 0 top
TP18  TEST-POINTPOGO_PTH  [1X01_NO_SILK]  88.65,73.24 0 top
TP19  TEST-POINTPOGO_PTH  [1X01_NO_SILK]  55.19,76.26 0 top
TP20  TEST-POINTPOGO_PTH  [1X01_NO_SILK]  111.84,56.33 0 top
U1  ESP32-WROOM-32D  [MODULE_ESP32-WROOM-32D]  58.63,32.65 180 bottom
U$2  BOOST_MODULE  [BOOST]  83.42,30.58 270 top
U$7  47219-2001_MICROSD  [47219-2001_MICROSD]  20.43,35.73 270 bottom
UART1  [MA02-1]  40.8,54.3 90 top
UART_STM  [MA06-1]  17.83,4.07 0 top
USB-C  CSP-USC16-TR  [USB-C]  125.65,23.85 90 top
VT1  ADC-028-2-T  [DCJACK_2MM_SMT]  130,46.9 180 top
Y1  6MM_3.5MM_CRYSTAL  [ABMM2]  81.88,55.68 0 top

## Tracks (layer width: path | path; a pad name or v marks a point on that pad's centre or on a via)
+3V3  (via drill 0.5)
  Top 0.254: STM32F303VE.100 v72.03,47.02 | R33.1 72.38,38.48 v72.38,37.44 | C6.1 60,65.38 STM32F303VE.50 | STM32F303VE.28 C8.1 | C5.1 56.33,49.16 57.57,50.4 STM32F303VE.75 | v8.53,54.29 8.53,54.94 D21.K | v6.99,56.38 7.32,56.05 D34.K | EXPANSION.4 104.72,66.58 v104.66,66.64 | C3.1 arc-45 72.27,46.09 72.06,46.3 | R20.2 16.19,57.76 arc-45 16.2,57.76
  Top 0.305: 72.02,46.34 v72.03,47.02 arc-90 72.03,46.86 72.06,46.8 72.06,46.3 | EXPANSION.24 103.3,40.1 v103.3,40.06 | C45.1 20.03,25.62 20.03,24.83 20.34,24.52 v20.88,24.52 19.85,24.52 R7.2 | RJ1.2 18.21,42.74 v18.27,42.67 | v18.27,42.67 18.28,42.7 arc-45 R1.2 C40.1 19.75,42.85 19.57,42.67 v18.27,42.67 | v10.7,27.15 RJ2.2
  Top 0.406: v59.03,67.36 59.15,67.25 C6.1 | v70.93,67.19 71,67.12 C8.1 | v55.16,49.38 55.86,49.38 C5.1 | FB5.2 120.1,17.59 v120.04,17.65
  Top 0.5: 16.2,57.76 17.89,56.06 arc-45 18.47,54.66 OLED.3
  Top 0.508: v122.49,35.37 123.82,35.37 R10.2 | R13.2 15.87,57.8 R20.2
  Top 0.813: MCP1825.3 110.68,37.13 C33.1 105.64,40.1 EXPANSION.24
  +3V3 0.5: v47.26,29.9 46.95,29.59 v46.95,27.58
  Bottom 0.305: 16.54,28.95 U$7.PIN4 19.51,28.95 v19.69,28.76 | 16.54,28.95 16.48,28.89 | 16.54,28.95 12.5,28.95 v10.7,27.15
  Bottom 0.406: SJ23.2 47.21,28.67 47.21,27.84 v46.95,27.58 | v42.62,30.33 41.59,30.33 v41.22,29.96 41.08,29.82 C26.1 41.27,28.83 C25.1 | v42.62,30.33 43.85,30.33 v43.89,30.29 44.89,30.29 | 44.89,30.29 v44.93,30.25 | 44.89,30.29 44.89,29.12 C24.1 C25.1 | C25.1 42.62,29.31 v42.62,30.33 | C25.1
  Bottom 0.5: SJ23.2 47.25,29.89 arc-45 v47.26,29.9
  other vias: 110.08,37.77
  pour +3V3: 138.44,41.4 138.44,0.36 127.28,-10.79 2.92,-10.79 -9.34,1.47 -9.34,71.35 -1.35,79.35 5.28,79.35 21.34,63.29 51.6,63.29 56.41,68.09 59.73,68.09 61.47,66.35 61.47,62.18 63.13,60.52 66.96,60.52 69.56,63.12 69.56,68.15 72.54,68.15 72.54,55.6 76.33,51.81 76.33,47.32 76.23,47.22 76.23,46.2 79.09,43.34 92.82,43.34 101.69,52.21 101.69,66.16 102.61,67.57 105.49,67.57 107.21,65.86 107.21,40.19 106.72,39.7 108.56,37.86 133.4,37.86 134.79,39.25
+3V3ANA  (via drill 0.5)
  Top 0.254: v109.89,64.31 D31.K | v109.93,56.22 D32.K | v9.44,87.7 D15.K | v22.04,87.65 23.17,87.65 D16.K | v34.82,87.66 35.91,87.66 D19.K | v47.6,87.66 48.64,87.66 D24.K | v60.05,87.78 61.3,87.78 D20.K | v73,87.66 74.09,87.66 D25.K | v85.72,87.78 86.75,87.78 D27.K | v98.33,87.61 99.49,87.61 D28.K | v111.14,87.68 112.29,87.68 D29.K
  Top 0.305: D1.K 53.1,67.35 53.09,67.38 52.41,67.38 v52.37,67.42
  Top 0.508: v77.27,67.37 arc45 77.61,67.23 | D30.K 109.56,72.72 v109.56,71.8 | 109.96,46.74 109.92,46.74 | MCP1825(ANALOG).3 110.27,46.74 | 110.27,46.74 109.96,46.74 | 109.96,46.74 v109.92,46.78 109.92,47.62 v109.98,47.68 110.93,46.74 MCP1825(ANALOG).3 | MCP1825(ANALOG).3 109.94,48.03 v109.94,48.8 110.49,49.36 v110.49,49.71 | MCP1825(ANALOG).3 110.49,47.48 v110.49,49.71 | MCP1825(ANALOG).3 111.5,47 v111.5,49.97 110.75,49.97 v110.49,49.71 | 109.96,46.74 108.15,44.92 C43.1 110.27,46.74
  Top 1.016: MCP1825(ANALOG).3 v111.23,48.68 arc-45 v111.24,48.69
  +3V3 0.508: v9.44,87.7 21.99,87.7 v22.04,87.65 34.81,87.65 v34.82,87.66
  other vias: 77.17,66.31 77.26,64.56
  pour Top (isolate 0.178, rank 3): 76.21,68.6 79.58,68.11 79.71,67.14 79.15,66.54 79.23,65.77 79.33,63.46 79.28,63.13 78.45,62.84 78.15,62.31 76.07,62.31
  pour +3V3 (rank 6): -2.78,90.46 -0.14,90.46 13.47,76.84 41.21,76.84 51.62,66.43 52.8,66.43 56.81,70.44 75.63,70.44 75.63,64.74 76.48,63.89 77.96,63.89 83.55,69.48 96.37,69.48 96.99,70.09 105.92,70.09 109.07,66.95 109.07,43.98 111.11,41.94 122.16,41.94 132.53,52.3 132.53,88.82 130.59,90.75 -1.83,90.75 -3.29,92.21
+5V  (via drill 0.5)
  Top 0.178: D36.A 91.77,42.4 93.39,40.78 93.39,35.8
  Top 0.305: RJ2.7 17.47,20.79 19.42,18.84 C47.1 | C42.1 18.36,36.39 RJ1.7 | 28.97,36.22 19.84,36.22 19.25,35.62 | 20.19,17.75 24.51,17.75 28.8,22.05 28.8,26
  Top 0.35: PCB2.P$44 24.43,73.18 arc90 C28.1 21.9,72.65 arc-90 C18.1 C27.1 | EXPANSION.26 104.27,37.11 104.18,37.11 103.56,37.11 arc-90 v103.08,37.59 | 91.11,60.34 arc90 C7.1 91.45,60.35 arc-90 92.2,59.6 arc90 92.93,58.87 SV1.3
  Top 0.356: 20.19,17.64 arc45 20.19,17.64 19.87,17.32 16.56,14.01 UART_STM.3
  Top 0.406: 20.19,17.64 20.19,17.75 | 19.95,18.31 20.25,18.01 20.25,18.82 C47.1 | 19.95,18.31 17.47,20.79 | 19.87,17.32 19.95,17.4 19.95,18.31 | v120.07,24.84 120.07,25.77 FB1.2 | 123.09,14.45 124.39,15.75 TP4.1 | C4.1 122.93,14.29 122.87,14.22 122.87,13.13 U$2.IN+
  Top 0.5: PCB2.P$42 PCB2.P$44 | 27.02,73.18 arc-90 28.97,71.23 28.97,36.22 28.97,26 | 28.8,26 28.97,26 | 28.97,26 32.7,26 arc90 33.9,27.2 33.9,29.54 | 73.64,35.8 93.39,35.8 101.36,35.8 101.91,35.8 arc45 103.7,36.54 EXPANSION.26
  Top 0.508: U$2.IN+ 123.09,13.25 123.09,14.45 | SV1.3 90.56,58.87 FB6.2 91.12,59.42 C7.1 | C12.1 118.53,26.87 119.74,26.87 FB1.2 118.73,27.88 arc45 116.94,28.62 111.11,28.62 arc-45 109.31,29.37 103.62,35.06 arc45 101.83,35.8 101.36,35.8 | 33.9,29.54 arc-45 34.51,31.01 36.94,33.44 67.02,33.44 arc45 68.82,34.19 69.69,35.06 arc-45 71.48,35.8 73.64,35.8 | FB8.2 119.57,46.78 121.19,45.16 121.19,39.31 119.57,37.7 | PCB2.P$44 27.02,73.18 | SV2.3 39.67,22.96 C10.1 39.05,23.32 36.37,26 32.7,26 | C42.1 19.2,35.58 19.25,35.62
  Top 0.813: C15.1 118.43,26.8 C12.1 | FB1.2 120.46,36.81 119.57,37.7 FB9.2
  Bottom 0.35: SV1.3 102.06,58.87 arc-90 104.6,56.33 104.6,39.11 arc90 v103.08,37.59
  Bottom 0.406: 101.59,7.76 105.02,11.2 119.74,11.2 121.62,13.08 U$2.IN+ | TP4.1 120.07,20.84 v120.07,24.84
  Bottom 0.508: 101.59,7.76 TB2.P$6
+5V_A
  Top 0.254: FB8.1 117.48,46.74 117.48,46.14 C39.1
  Top 0.508: MCP1825(ANALOG).1 117.48,46.74 | FB8.1 117.52,46.1 C39.1
+5V_D
  Top 0.813: FB9.1 117.49,37.76 MCP1825.1 118.98,34.69 C21.1
+5V_REF
  Top 0.254: 87.24,63.43 87.24,62
  Top 0.508: C11.1 87.17,64.73 | 87.24,63.36 87.24,62.16 PS1.2 PS1.3 87.24,63.43 87.24,64.67 87.17,64.73 | 87.24,62 87.24,59.48 88.08,58.63 FB6.1 | C37.1 87.21,65.87 87.17,65.83 87.17,64.73
+5V_USB
  Top 0.508: USB-C.A4/B9 125.84,21.45 arc45 126.77,21.83 arc45 127.42,23.42 127.42,24.35 arc45 126.83,25.77 arc45 125.68,26.25 USB-C.B4/A9 122.38,26.25 arc45 FB1.1 arc-45 122.61,25.06 C34.1 arc-45 122.27,24.23 D40*1.K
+24V
  Top 0.178: U$2.OUT+ 84.43,14.1 R17.2 86.3,15.68 86.9,15.08
  Top 0.254: 86.9,13.93 86.9,9.08 84.15,6.33
  Top 0.3: R9.2 R11.2 86.9,15.08 86.9,13.93
  Top 0.305: TB2.P$1 84.09,6.27 arc-90 84.15,6.33
AC1  (via drill 0.5)
  Top 0.254: 118.29,61.02 arc90 SJ37.2 120.48,61.12 arc45 R43.2 v122,61.22 122.16,61.22 arc45 122.81,61.49 arc-45 124.39,62.14 TERM3.P$2 | v123.5,43.18 123.5,42.14 arc45 VT1.PWR2 124.02,41.62 arc45 v124.67,43.2
  Bottom 0.254: TERM3.P$2 123.49,58.96 arc45 122.74,57.16 122.74,44.98 arc45 123.49,43.19 v123.5,43.18 | v124.67,43.2 123.89,43.98 arc-45 123.2,45.65 123.2,59.72 arc45 122.99,60.23 v122,61.22
AC1_
  Top 0.254: R25.1 JP9.2 117.02,60.18 SJ37.1 R53.1 R43.1
AC2
  Top 0.254: SJ36.2 119.66,68.87 R42.2 arc-45 122.98,66.96 123.55,66.39 arc45 125.35,65.64 TERM3.P$3
AC2_
  Top 0.254: R42.1 120.02,66.42 R52.1 SJ36.1 JP6.2 R26.1
AC3
  Top 0.254: SJ35.2 119.41,76.33 arc-45 R41.1 arc-45 121.83,75.32 121.92,75.23 arc-45 122.45,73.97 122.45,73.67 arc45 123.19,71.87 125.39,69.68 arc45 TERM3.P$4
AC3_
  Top 0.254: R27.1 JP5.2 SJ35.1 R51.1 R41.2
ADC_2_RJ45IN  (via drill 0.5)
  Top 0.178: STM32F303VE.61 59.71,57.4 60.17,56.94 60.17,56.24 60.53,55.88 60.53,54.45 v60.43,54.34 | v48.57,50.84 48.19,51.21 45.93,51.21
  Top 0.203: 45.93,51.21 44.16,51.21 41.77,48.83 38.3,48.83 35.42,45.95 v35.42,45.3 | v23.47,40.06 23.36,39.95 v23.36,37.38 | v10.58,19.52 RJ2.8
  Bottom 0.178: v60.43,54.34 60.23,54.15 57.48,54.15 55.17,51.84 48.91,51.84 48.57,51.5 v48.57,50.84
  Bottom 0.203: v35.42,45.3 34.31,44.19 34.31,42.28 33.6,41.57 24.97,41.57 v23.47,40.06 | v23.36,37.38 22.63,36.65 22.63,35.07 21.9,34.34 17.09,34.34 13.28,30.53 11.86,30.53 9.07,27.73 9.07,21.03 v10.58,19.52
ADC_RJ45IN  (via drill 0.5)
  Top 0.178: STM32F303VE.54 58.37,60.78 59.1,60.78 61.83,58.05 61.83,56.71 61.29,56.17 v61.29,52.37 | v49.51,51.23 48.92,51.81 46.12,51.81
  Top 0.203: 46.12,51.81 43.79,51.81 41.43,49.46 37.98,49.46 34.47,45.95 v34.47,45.35 | v24.45,43.9 23.86,43.3 v23.86,41.84 | v14.42,34.12 14.42,35.06 RJ1.8
  Bottom 0.178: v61.29,52.37 61.29,52.23 60.39,51.33 49.61,51.33 v49.51,51.23
  Bottom 0.203: v34.47,45.35 33.01,43.9 v24.45,43.9 | v23.86,41.84 16.13,34.12 v14.42,34.12
AGND  (via drill 0.5)
  Top 0.254: 60.01,72.95 CF6.1 | 50.16,73 CF8.1 | EXPANSION.1 99.61,68.77 101.26,68.77 arc-45 v100.95,68.9 | EXPANSION.2 104.58,68.18 arc45 v102.89,68.88
  Top 0.508: FB3.2 112.92,22.62 arc45 v112.87,22.6 112.87,23.25 | FB3.2 113.31,23.52 arc45 v112.96,23.66 | FB3.2 arc-45 113.98,23.16 | 113.98,23.16 v113.98,23.95 | 112.87,23.25 112.87,23.47 arc-45 v112.96,23.66 | v112.96,23.66 113.3,23.66 arc45 v113.98,23.95 | v113.98,23.95 113.64,23.95 arc45 v112.96,23.66 | v112.96,23.66 arc-45 113.85,23.3 113.98,23.16 | FB3.2 arc-45 113.01,23.11 112.87,23.25
  other vias: 5.13,96.32 15.39,100.54 28.01,100.67 41.16,100.4 52.47,100.8 65.62,100.8 78.24,100.54 91.39,100.8 104.41,100.14 117.3,100.8 69.38,67.05 55.93,68.03 71.8,59.64 70.78,59.67 81.88,66.09 81.96,67.13 90.07,65.3 87.95,65.5 88.91,65.48 56.93,65.81 20.53,79.07 127.56,48.95 116.46,40.66 113.59,42.44 110.83,40.59 48.17,62.62 47.25,62.46 49.63,57.17 52.14,57.08 120.23,40.58 120.26,41.58 118.81,41.16 117.01,42.92 118.73,49.12 120.25,47.54 113.47,44.68 113.61,48.82 114.65,48.82 112.48,48.88 114.57,44.66 112.34,44.54 108.92,41.09 109.85,42.63 110,41.52 111.7,70.79 111.4,78.38 109.53,77.75 109.92,70.72 109.92,62.74 111.93,63.33 111.07,83.29 98.44,83.21 85.67,83.29 72.97,83.33 60.15,83.33 47.37,83.33 34.71,83.25 22.01,83.25 9.43,83.41 65.54,62.55 58.72,72.92 53.7,72.93 48.69,72.97 43.61,72.97 63.68,72.93 68.61,73.01 73.62,72.93 78.43,72.97 83.6,72.97 80.43,60.01 80.39,60.97 81.59,63.58 121.74,71.75 120.63,65.14 128.96,66.42 122.18,43.21
  pour GND (rank 6): 8.15,121.68 116.38,121.68 arc-90 139.77,98.29 139.77,47.44 arc-90 132.96,40.63 112.58,40.63 arc-90 108.88,44.33 108.88,65.73 arc90 105.45,69.16 93.39,69.16 arc90 90.97,66.74 90.97,60.66 arc-90 89.52,59.21 46.92,59.21 arc-90 46.26,59.87 46.26,63.44 arc90 43,66.7 38.6,66.7 arc-90 36.44,68.85 36.44,73.7 arc90 32.61,77.53 13.6,77.53 arc-90 7.61,83.51 7.61,91.88 arc90 6.3,93.19 3.11,93.19 arc-90 -3.2,99.5 -3.2,117.5 arc-90 4.02,124.71
  pour Top (isolate 0.203, rank 6): -7.06,121.68 116.38,121.68 arc-90 139.77,98.29 139.77,47.44 arc-90 132.36,40.04 110.51,40.04 arc-90 107.95,42.59 107.95,68.19 92.42,68.19 arc90 90.97,66.74 90.97,60.66 arc-90 88.96,58.65 47.48,58.65 arc-90 46.26,59.87 46.26,63.44 arc90 43,66.7 38.6,66.7 arc-90 36.44,68.85 36.44,73.7 arc90 32.61,77.53 13.6,77.53 arc-90 7.61,83.51 7.61,86.58 arc90 -1.76,95.95 -1.76,116.38 arc-90
  pour Top: 47.42,60.09 54.66,60.09 54.66,56.71 54.66,56.42 47.28,56.42
  pour GND: 47.44,60.09 54.68,60.09 54.68,56.71 54.68,56.42 47.3,56.42
  pour Bottom (isolate 0.203, rank 6): 8.15,121.68 116.38,121.68 arc-90 139.77,98.29 139.77,47.44 arc-90 132.36,40.04 110.51,40.04 arc-90 107.95,42.59 107.95,68.19 92.42,68.19 arc90 90.97,66.74 90.97,60.66 arc-90 89.27,58.96 47.16,58.96 arc-90 46.26,59.87 46.26,63.44 arc90 43,66.7 38.6,66.7 arc-90 36.44,68.85 36.44,73.7 arc90 32.61,77.53 13.6,77.53 arc-90 7.61,83.51 7.61,91.88 arc90 6.3,93.19 3.11,93.19 arc-90 -3.2,99.5 -3.2,117.5 arc-90 4.02,124.71
  pour GND (isolate 0.305, rank 3): 109.99,46.62 arc-90 110.13,46.77 120.12,46.77 arc-90 121.16,45.72 121.16,39.95 121.16,38.29 arc-90 119.88,37.02 arc90 118.13,35.26 118.13,32.76 118.13,24.57 arc-90 115.05,21.49 112.45,21.49 arc-90 110.18,23.76 110.18,35.36 arc90 109.09,36.45 arc-90 108.38,37.16 108.38,45.91
ANT
  Top 0.406: C48.1 109.31,9.72 arc-45 109.26,9.74
  Top 1.524: J$1.SIG 109.26,9.74 109.26,11.51 arc-90 RFM69HCW.8
BIAS  (via drill 0.5)
  Top 0.254: 55.49,63.91 | 55.49,63.91 arc32 55.11,65.22 arc20 54.05,66.39 arc37 53.71,66.5 | 53.71,66.5 48.06,66.5 | 48.06,66.5 39.05,66.5 arc-90 37.35,68.2 37.35,74.94 arc90 33.98,78.31 25.7,78.31 arc-90 24.03,79.98 arc90 22.62,81.39 10.27,81.39 arc-90 8.13,83.53 8.13,96.07 | 11.11,104.49 CT9.P$1 arc90 10.99,104.61 10.03,104.61 | VT1.GNDBREAK VT1.GND 130,60.6 | v56.34,67.01 56.19,67.01 arc-45 55.77,66.64 54.93,66.64 | 53.71,66.5 54.93,66.5 54.93,66.64 | 55.61,63.98 55.61,64.44 R6.1 | 55.61,63.98 55.49,63.91 | 130,60.6 128.04,58.64 TERM3.P$1 124.88,56.85 117.29,56.85 | 130,60.6 130,60.64 | 130,60.64 130,63.97 | 130,63.97 130,67.44 | 130,67.44 130,88.8 130,88.98 | RB6B.2 arc90 54.49,86.92 | R53.2 117.29,56.85 | v109.84,53.02 113.46,53.02 117.29,56.85 | 54.93,66.64 54.93,66.99 D1.A 54.85,65.98 D14.K | 130,60.64 130.02,60.64 130,60.6 | 48.06,66.5 TP5.1 47.18,68.25 C35.1 | RB8B.2 28.62,85.59 RB8A.2 | 24,104.32 CT8.P$1 24,104.48 arc-90 24.13,104.61 | CT7.P$1 36.7,104.4 arc-90 36.91,104.61 | CT6.P$1 49.4,104.45 arc-90 49.55,104.61 | CT5.P$1 62.1,104.52 arc90 62.01,104.61 | CT4.P$1 74.8,104.38 arc-90 75.03,104.61 | CT3.P$1 87.5,104.39 arc-90 87.72,104.61 | CT2.P$1 100.2,104.35 arc-90 100.46,104.61 | 55.61,63.98 55.61,63.76 C20.1 52.63,62.89 R37.1 | JP11.1 82.56,90.5 82.2,90.5 | JP13.1 69.84,90.45 69.51,90.45 | JP15.1 57.08,90.32 56.82,90.32 | JP18.1 44.23,90.45 43.52,90.45 | JP17.1 31.76,90.53 31.66,90.64 | 130,63.97 120.16,63.97 arc-45 119.31,64.32 R52.2 | R51.2 117.12,73.81 121.66,69.26 arc45 126.04,67.44 130,67.44 | CT1.P$1 113.21,104.61 112.92,104.61 arc90 112.9,104.59 CT1.P$1
  Top 0.356: 130,88.8 arc90 120.19,98.61 | 8.13,96.07 arc-90 10.68,98.61 11.3,98.61 | 120.19,98.61 112.9,98.61 | 112.9,98.61 108.82,98.61 | 108.82,98.61 100.2,98.61 | 100.2,98.61 96.2,98.61 | 96.2,98.61 87.5,98.61 | 87.5,98.61 82.2,98.61 | 82.2,98.61 74.8,98.61 | 74.8,98.61 69.51,98.61 | 69.51,98.61 62.1,98.61 | 62.1,98.61 56.82,98.61 | 56.82,98.61 49.4,98.61 | 49.4,98.61 43.52,98.61 | 43.52,98.61 36.7,98.61 | 36.7,98.61 31.66,98.61 | 31.66,98.61 24,98.61 | 24,98.61 19,98.61 | 19,98.61 11.3,98.61 | CT9.P$1 11.3,98.61 | CT8.P$1 24,98.61 | CT7.P$1 36.7,98.61 | CT6.P$1 49.4,98.61 | CT5.P$1 62.1,98.61 | CT4.P$1 74.8,98.61 | CT3.P$1 87.5,98.61 | CT2.P$1 100.2,98.61 | CT1.P$1 112.9,98.61 | C36.1 130,88.98 | R34.2 121.51,98.61 120.19,98.61 | RB4B.2 79.35,85.64 | 79.35,85.64 79.35,85.58 | 79.35,85.58 RB4A.2 | 79.35,85.58 79.66,85.58 arc90 82.2,88.12 82.2,90.5 82.2,98.61 | R36.2 96.2,98.61 | R35.2 108.82,98.61 | RB5B.2 66.71,85.64 | 66.71,85.6 RB5A.2 | 66.71,85.6 66.97,85.6 arc90 69.51,88.14 69.51,90.45 69.51,98.61 | RB6B.2 54.04,85.64 | 54.04,85.56 RB6A.2 | 54.04,85.56 54.28,85.56 arc90 56.82,88.1 56.82,90.32 56.82,98.61 | RB7A.2 41.27,85.59 | 41.27,85.64 RB7B.2 | 41.27,85.59 arc90 43.52,87.84 43.52,90.45 43.52,98.61 | 28.62,85.59 29.12,85.59 | 29.12,85.59 arc90 31.66,88.13 31.66,90.64 31.66,98.61 | 19,90.42 19,88.24 arc-90 16.46,85.7 16.02,85.7 arc90 15.97,85.65 | 19,90.42 19,98.61 | RB9B.2 15.97,85.65 | 15.97,85.65 RB9A.2 | RB8B.2 RB8A.2 | JP16.1 arc-45 19.1,90.51 18.46,90.51 arc45 18.68,90.42 19,90.42 | RB9_.2 15.99,85.64 | 29.12,85.59 32.76,85.59 RB8_.2 | RB7_.2 41.27,85.64 | 41.27,85.64 41.27,85.59 | RB6_.2 54.04,85.64 | 54.04,85.64 54.04,85.56 | RB5_.2 66.71,85.64 | 66.71,85.64 66.71,85.6
  Top 0.356: RB4_.2 79.35,85.64
  Top 1.27: 15.99,85.64 arc-45 15.97,85.65
  Bottom 0.254: v56.34,67.01 60.6,71.24 107.82,71.24 arc-27 108.99,66.32 108.99,53.88 arc90 v109.84,53.02
BIAS_
  Top 0.254: STM32F303VE.51 58.25,63.85 R6.2
BIAS_IN
  Top 0.254: R23.2 50.09,58.9 STM32F303VE.58
  Top 0.406: R23.2 50.01,59.98 R22.1 50.42,60.71 TP10.1 47.79,60.83 C50.2 47.82,58.98 R23.2
BOOT0_RPI
  Top 0.178: J1.2 34.75,66.75 33,66.75 31.75,68 PCB2.P$47
BOOT_STM  (via drill 0.5)
  Top 0.178: R2.1 69.42,39.2 v68.73,39.2 | v71.05,34.03 71.05,33.35 72.63,31.76 75.47,31.76 76.45,32.75 v80.82,32.75
  Top 0.203: R2.1 69.73,42.6 69,43.34 STM32F303VE.94 69,51.55 v66.16,54.39 | v35.27,65.31 34.87,65.71 J1.1
  Bottom 0.178: v68.73,39.2 69.63,39.2 70.37,38.46 70.37,34.71 v71.05,34.03 | v80.82,32.75 80.82,29.89 82.25,28.46 89.15,28.46 94.42,23.19 94.42,14.47 95.33,13.57 99.51,13.57 105.15,19.21 109.8,19.21 | 118.39,15.22 123.53,15.22 128.04,10.71 BOOT_STM.1
  Bottom 0.203: v35.27,65.31 35.88,65.31 47.67,53.52 53.84,53.52 56.33,56.01 59.68,56.01 61.24,54.45 66.1,54.45 v66.16,54.39 | 109.8,19.21 111.11,20.52 111.11,22.92 112.78,24.58 114.24,24.58 114.27,24.55 114.83,24.55 115.7,23.68 115.7,21.66 118.39,18.98 118.39,15.22
BUTTON1
  Top 0.178: PCB2.P$53 31.75,60.48 33.02,60.48 SJ3.1 33.16,61.44 34,61.44 34.97,62.41 34.97,63.61 34.41,64.18 30.32,64.18 30.01,64.48
  Top 0.203: S1.2 2.74,73.86 16.54,73.86 19.49,76.82 27.85,76.82 30.01,74.65 30.01,64.48 | 31.29,60.48 PCB2.P$53
BUTTON1_STM  (via drill 0.5)
  Top 0.178: STM32F303VE.53 57,61.4 v56.58,61.83 | v40.09,63.27 39.62,63.74 36.51,63.74 35.46,62.69 35.46,61.88 SJ3.2
  Bottom 0.178: v56.58,61.83 56.58,59.37 51.34,54.13 47.92,54.13 40.2,61.85 40.2,63.16 v40.09,63.27
CAN_RX  (via drill 0.5)
  Top 0.203: v75.73,43.29 75.61,43.17 75.61,41.97 76.59,40.99 78.06,40.99 80.95,38.09 89.68,38.09 91.43,39.85 CANBUS.1 | v63,51.39 62.5,50.89 STM32F303VE.81
  Bottom 0.203: v75.73,43.29 75.65,43.29 74.27,44.67 74.27,47.28 70.56,50.99 63.39,50.99 v63,51.39
CAN_TX  (via drill 0.5)
  Top 0.203: v76.18,44.31 76.38,44.11 76.38,41.71 76.69,41.39 78.2,41.39 79.74,39.85 CANBUS.2
  Top 0.254: STM32F303VE.82 63,50.32 v64.31,51.69
  Bottom 0.203: v76.18,44.31 76.09,44.4 75.14,44.4 74.71,44.83 74.71,47.59 70.89,51.41 64.6,51.41 v64.31,51.69
CT1
  Top 0.254: RF1.2 86.73,72.97 arc90 CF1.2 | CF1.2 86.75,72.35 arc-90 84.21,69.81 70.04,69.81 arc90 67.5,67.27 STM32F303VE.35 | CF1.2 88.36,72.95 TP18.1
CT2
  Top 0.254: RF2.2 81.76,72.97 arc90 CF2.2 arc-90 79.29,70.46 77.52,70.46 73.04,70.46 69.54,70.46 arc90 67,67.92 STM32F303VE.36
CT3
  Top 0.254: CF3.2 76.81,75.18 arc90 RF3.2 | CF3.2 arc-90 74.87,71.01 | CF3.2 76.81,72.94 arc-90 74.89,71.02 69.16,71.02 arc90 66,67.86 STM32F303VE.38
CT4
  Top 0.254: RF4.2 CF4.2 arc90 CF4.2 arc-90 70.58,71.69 68.62,71.69 arc90 65.5,68.57 STM32F303VE.39
CT5
  Top 0.254: RF5.2 66.89,72.92 CF5.2 66.95,72.86 66.95,72.15 arc90 65,70.2 STM32F303VE.40
CT6
  Top 0.254: RF6.2 CF6.2 61.89,71.29 arc90 62.31,70.86 arc-90 64.5,68.67 STM32F303VE.41
CT7
  Top 0.254: CF7.2 RF7.2 arc-45 55.78,75.66 TP19.1 | CF7.2 56.91,72.56 | CF7.2 56.91,72.27 arc90 59.09,70.09 61.46,70.09 arc-90 64,67.55 STM32F303VE.42
CT8
  Top 0.254: RF8.2 CF8.2 51.94,71.9 arc90 54.48,69.36 60.96,69.36 arc-90 63.5,66.82 STM32F303VE.43
CT9
  Top 0.254: RF9.2 CF9.2 46.97,71.33 arc90 49.51,68.79 60.46,68.79 arc-90 63,66.25 STM32F303VE.44
CT_IN1
  Top 0.254: RF1.1 86.73,78.15 arc-90 89.27,80.69 113.1,80.69 arc90 115.64,83.23 RB1A.1
  Top 0.356: CT1.P$2 112.9,90.71 arc45 113.64,88.91 RB1B.1 | D29.A 113.82,87.69 arc-45 115.61,86.94 RB1B.1 | D13.K arc45 115.32,83.95 RB1A.1 115.64,85.64 | RB1B.1 115.64,86.34 115.64,85.64 | RB1_.1 115.64,85.64
CT_IN2
  Top 0.254: RF2.1 81.76,79.14 arc-90 84.01,81.39 100.31,81.39 arc90 102.86,83.93 RB2A.1
  Top 0.356: CT2.P$2 100.2,90.62 arc45 100.94,88.83 RB2B.1 | D28.A arc-45 102.81,86.97 RB2B.1 | D12.K arc45 102.5,83.91 RB2A.1 102.86,85.64 | RB2B.1 102.86,86.01 102.86,85.64 | RB2_.1 102.86,85.64
CT_IN3
  Top 0.254: RF3.1 76.79,78.06 arc-90 80.94,82.2 88.28,82.2 arc90 RB3A.1
  Top 0.356: CT3.P$2 87.5,90.82 arc45 88.24,89.02 RB3B.1 | D27.A 88.53,87.69 arc-45 90.32,86.94 RB3B.1 | D11.K 88.33,83.31 arc45 90.13,84.05 RB3A.1 90.35,85.64 | RB3B.1 90.35,85.96 90.35,85.64 | RB3_.1 90.35,85.64
CT_IN4
  Top 0.254: RB4A.1 77.45,83.84 | 77.45,83.84 77.45,83.74 | RF4.1 71.83,79.23 arc-90 74.36,81.77 75.37,81.77 arc90 77.45,83.84
  Top 0.356: CT4.P$2 74.8,90.62 arc45 75.54,88.83 RB4B.1 | D25.A D25.A arc-45 77.43,86.94 RB4B.1 | D10.K arc45 77.12,83.94 RB4A.1 77.45,85.64 | RB4B.1 77.45,85.99 77.45,85.64 | RB4_.1 77.45,85.64
CT_IN5
  Top 0.254: CT5.P$2 62.52,94.28 | 64.81,84.08 64.81,82.85 arc45 65.56,81.06 66.11,80.5 arc-45 66.86,78.7 RF5.1
  Top 0.356: RB5_.1 64.81,85.64 RB5B.1 | RB5B.1 RB5A.1 | RB5A.1 64.81,84.08 | CT5.P$2 62.1,90.68 arc45 62.84,88.89 RB5B.1 | D20.A 62.99,87.69 arc-45 64.79,86.94 RB5B.1 | D9.K arc45 64.54,84 RB5A.1
CT_IN6
  Top 0.254: RF6.1 61.89,79.3 arc90 59.35,81.84 53.94,81.84 arc-90 52.14,83.64 RB6A.1
  Top 0.356: CT6.P$2 49.4,90.71 arc45 50.14,88.91 RB6B.1 | D24.A 50.32,87.69 arc-45 52.12,86.94 RB6B.1 | D8.K arc45 51.91,84.04 RB6A.1 52.14,85.35 52.14,85.64 | 52.14,85.64 RB6B.1 | RB6_.1 52.14,85.64
CT_IN7
  Top 0.254: RF7.1 56.92,78.46 arc90 54.38,81 41.91,81 arc-90 39.37,83.54 39.37,84.18 RB7A.1
  Top 0.356: 39.37,85.63 RB7B.1 39.35,86.94 | 39.37,85.63 39.37,84.18 39.35,84.18 arc45 37.55,83.43 D7.K | 39.35,86.94 arc45 37.55,87.69 D19.A | CT7.P$2 36.7,90.64 arc45 37.44,88.85 39.35,86.94 | 39.37,85.63 RB7_.1
CT_IN8
  Top 0.254: RF8.1 51.95,77.55 arc90 49.41,80.09 29.27,80.09 arc-90 26.73,82.63 26.73,84.18 RB8A.1
  Top 0.356: CT8.P$2 24,90.7 arc45 24.74,88.9 RB8B.1 | D16.A 24.91,87.69 arc-45 26.7,86.94 RB8B.1 | D6.K 26.73,84.18 | RB8A.1 26.73,85.64 | 26.73,85.64 RB8B.1 | RB8_.1 26.73,85.64
CT_IN9
  Top 0.254: CT9.P$2 arc90 11.98,94.02 | RF9.1 arc90 44.68,79.19 30.56,79.19 27.51,79.19 arc-90 25.33,81.37 arc90 24.45,82.25 16.09,82.25 arc-90 RB9A.1
  Top 0.356: CT9.P$2 11.3,90.74 arc45 12.04,88.95 RB9B.1 | RB9B.1 14.07,85.61 | 14.07,85.61 RB9A.1 13.86,84.05 arc-45 12.06,83.31 D5.K | D15.A 12.25,87.69 arc-45 14.05,86.94 RB9B.1 | RB9_.1 14,85.64 arc-45 14.07,85.61
DGND  (via drill 0.5)
  Top 0.178: C31.2 86.71,45.84 v86.42,46.13 | C32.2 88.48,53.06 v89.08,53.06 | C30.2 88.89,55.56 v88.89,55.7 | C29.2 87.94,56.73 v87.94,55.75
  Top 0.203: 14.45,41.44 RJ1.3
  Top 0.254: 71.5,49.56 STM32F303VE.99 71.5,50.24 65.73,56.01 65.73,56.03 65.71,56.02 | 16.5,38.93 RJ1.5 10.86,38.93 v10.57,38.65 | C30.2 arc-45 87.94,54.79 v87.94,55.75 | 11.79,25.87 RJ2.3 10.76,25.87 10.65,25.75 | C40.2 arc45 18.01,44.01 RJ1.1 10.56,44.01 10.56,42.83 v10.51,42.78 10.6,42.69 10.6,41.44 14.45,41.44 | EXPANSION.14 104.62,52.88 103.38,52.88 v103.34,52.84 | RJ2.5 v10.68,23.33 10.65,23.36 | C6.2 60.5,65.89 STM32F303VE.49 60.5,62.04 65.71,56.83 65.71,56.02 | C8.2 72.56,66.07 71.5,65.01 STM32F303VE.27 71.5,62.74 65.73,56.97 | C5.2 56.61,50.9 STM32F303VE.74 61.03,50.9 65.71,55.59 65.71,56.02 | C22.2 90.66,11.23 v90.05,11.84
  Top 0.3: v92.29,28.15 arc-90 92.25,28.19 R16.1 92.25,29.51 | v90.97,23.26 arc-90 91,23.23 R14.1 arc90 88.65,19.9 R15.1 | Q3.2 83.72,20.35 arc-90 v83.96,20.11 | EXPANSION.25 97.36,37.56 v97.36,37.58 | 0.84,81.6 LED3.C 0.91,81.7 0.91,85.36 LED2.C LED1.C | C19.2 6.97,58.62
  Top 0.305: C45.2 18.9,28.45 16.54,28.45 | C41.2 21.26,37.67 v21.68,37.26 | PCB2.P$70 24.94,40.16 arc-45 v24.82,40.21 | PCB2.P$74 25.04,35.08 arc45 v24.78,34.97 | v33.07,28.03 31.75,27.48 PCB2.P$79 | PCB2.P$65 32.86,45.24 arc45 v32.95,45.28 | PCB2.P$60 25.62,52.86 arc-45 v24.83,52.53 | PCB2.P$49 32.1,65.56 arc45 v32.97,65.92 | PCB2.P$54 25.05,60.48 arc45 v24.85,60.39 | PCB2.P$46 24.94,70.64 arc-45 v24.86,70.67 arc45 24.18,70.95
  Top 0.35: C7.2 arc-90 92.81,63.95 SV1.1 | 129.82,30.55 S2.1
  Top 0.406: v22.9,19.85 21.92,20.83 C46.2
  Top 0.5: v22.9,19.85 21.93,18.88 C47.2 | C27.2 C18.2 arc-45 22.04,70.95 v23.08,70.95 C28.2 24.18,70.95 arc-45 24.94,70.64 | v24.86,70.67 26.07,70.67 arc-45 PCB2.P$46
  Bottom 0.254: U1.39 58.02,34.26 v57.97,34.38
  Bottom 0.406: C26.2 43.08,26.94 arc-45 C25.2 | C25.2 arc-45 C25.2 | C25.2 C24.2 | 48.42,26.93 arc45 48.97,27.16 arc-45 49.54,27.39 U1.1
  Bottom 0.5: U1.38 66.18,27.39 arc-45 64.38,28.14 U1.39 58.27,35.54 arc-45 60.07,36.28 U1.31 | U1.15 52.9,43.08 arc45 54.09,40.21 57.39,36.91 v57.39,36.82 | U1.1 51.35,27.39 arc45 52.62,27.92 58.15,33.45 v58.15,35.59
  other vias: 65.68,57.45 126.52,37.41 59.43,34.53 55.95,36.85 59.2,36.84 59.37,35.67 65.23,56.54 23.59,21.86 66.19,56.54 10.56,25.74 19.74,46.92 33.08,27.17 25.84,33.97 27.3,40.12 30.48,45.16 32.97,65.07 27.36,70.59 100.26,57.82 110.78,31.55 112.46,33.53 110.9,30.17 129.49,32.07 77.09,34.14 89.4,20.89 10.65,35.88 22,35.33 0.9,84.07 20.02,32.96 87.64,32.7 111.04,33.13 112.92,21.49 112.93,20.59 56.92,35.7 56.64,34.44 55.78,35.27 44.22,25.64 41.83,25.68 43,25.62 55.16,50.45 65.74,55.52 59.71,32.57 58.62,32.51 57.18,32.51 55.7,32.53 73.44,43.68 39.43,44.22 65.37,36.15 29.85,33.74 27.95,37.61 27.98,46.29 27.86,58.98 73.87,37.04 36.88,50.91 120.56,5.17 120.83,6.26 119.58,6.04 29.78,49.58 29.75,40.68 108.8,33.41 107.69,33.67 106.56,34.02 108.61,32.13 119.04,31.03 119,30.11 119.1,29.23
  pour Top (isolate 0.203, rank 6): 132.69,38.66 109.48,38.66 arc-90 105.68,42.45 105.68,65.53 arc90 104.43,66.77 94.1,66.77 arc90 93.12,65.79 93.12,60.68 arc-90 90.39,57.95 57.99,57.95 arc90 56.97,56.94 arc-90 55.08,55.05 47.23,55.05 arc-90 44.72,57.56 44.72,62.82 arc90 42,65.53 37.04,65.53 arc-90 34.5,68.07 34.5,72.71 arc90 31.31,75.9 7.94,75.9 arc-90 5.35,78.5 5.35,88.21 arc90 2.81,90.75 -2.13,90.75 arc90 -7.42,85.46 -7.42,-0.27 arc90 31.97,-39.66 164.26,9.62 arc90 136.69,37.19
  pour GND (isolate 0.203, rank 6): 133.12,39.08 arc-90 132.69,38.66 109.48,38.66 arc-90 105.68,42.45 105.68,65.53 arc90 104.43,66.77 94.1,66.77 arc90 93.12,65.79 93.12,60.68 arc-90 90.44,58 58.04,58 arc90 56.97,56.94 arc-90 55.08,55.05 47.23,55.05 arc-90 44.72,57.56 44.72,62.82 arc90 42,65.53 37.04,65.53 arc-90 34.5,68.07 34.5,72.71 arc90 31.31,75.9 7.94,75.9 arc-90 5.35,78.5 5.35,88.21 arc90 2.81,90.75 -2.13,90.75 arc90 -2.24,90.64 -2.24,-5.45 arc90 7.15,-14.84 120.38,-14.84 arc90 139.44,4.21 139.44,34.44 arc90 136.69,37.19
  pour Bottom (isolate 0.203, rank 6): 133.29,38.75 arc-90 132.86,38.32 109.64,38.32 arc-90 105.84,42.12 105.84,65.2 arc90 104.6,66.44 94.26,66.44 arc90 93.28,65.46 93.28,60.35 arc-90 90.6,57.67 58.2,57.67 arc90 57.14,56.61 arc-90 55.25,54.72 47.39,54.72 arc-90 44.88,57.23 44.88,62.48 arc90 42.17,65.2 37.2,65.2 arc-90 34.66,67.74 34.66,72.38 arc90 31.47,75.57 8.11,75.57 arc-90 5.51,78.17 5.51,87.88 arc90 2.97,90.42 -1.96,90.42 arc90 -2.08,90.3 -2.08,-5.78 arc90 7.31,-15.17 120.55,-15.17 arc90 139.6,3.88 139.6,34.11 arc90 136.85,36.86
DIO0_RFM  (via drill 0.5)
  Top 0.178: v71.3,45.45 71,45.75 STM32F303VE.98 | v97.38,23.12 97.29,23.03 RFM69HCW.2
  Bottom 0.178: v71.3,45.45 71.3,44.83 74.2,41.92 82.12,41.92 97.38,26.66 v97.38,23.12
DS18B20_RJ45  (via drill 0.5)
  Top 0.178: TP9.1 21.41,22.8 R7.1
  Top 0.254: R7.1 18.03,24.6 RJ2.4 10.04,24.6 9.56,25.07 9.56,39.73 10.03,40.2 RJ1.4 18.95,40.2 R1.1 21.3,42.55 v21.3,42.79 | STM32F303VE.78 61,47.15 59.8,45.95 50.15,45.95 v49.97,46.13 | v33.37,42.75 33.8,42.75 36.3,45.25 36.3,46.16 37.64,47.49 v38.54,47.49
  Bottom 0.254: v38.54,47.49 46.89,47.49 46.9,47.5 48.6,47.5 v49.97,46.13 | v33.37,42.75 21.34,42.75 v21.3,42.79
ESP_PWR_PRE  (via drill 0.5)
  Bottom 0.178: v48.15,30.37 48.15,28.94 SJ23.1
  Bottom 0.5: SJ23.1 50,28.71 arc-45 U1.2
EXT_TERM1  (via drill 0.5)
  Top 0.178: STM32F303VE.63 57.25,56.4 57.23,56.42 53.41,56.42 51.53,54.53 46.76,54.53 39,62.28 v36.72,62.28 | v24,67.14 23.75,67.14 23.75,67.64 23.5,67.89 22.52,67.89 18.23,63.6 9.68,63.6 D17.K 8.85,64.23 C1.1 6.94,64.05 TERM1.P$2
  Bottom 0.178: v36.72,62.28 28.19,62.28 23.82,66.64 v24,67.14
EXT_TERM2  (via drill 0.5)
  Top 0.178: STM32F303VE.64 57.28,55.9 57.1,56.09 53.55,56.09 51.66,54.2 46.62,54.2 39.4,61.42 37.68,61.42 37.66,61.39 v37.18,61.39 | v22.99,67.19 18.9,63.09 12.23,63.09 11.92,62.79 | D18.K 7.87,60.42 C19.1 4.53,60.42 TERM1.P$3
  Top 0.203: D18.K 10.38,61.24 11.92,62.79
  Bottom 0.178: v37.18,61.39 28.61,61.39 22.99,67.02 v22.99,67.19
EXT_TERM3  (via drill 0.5)
  Top 0.178: STM32F303VE.87 65.51,48.66 65.51,49.51 v65.05,49.97 v65.05,49.98 | v88.81,8.65 88.81,9.12 D26.K
  Top 0.254: TB2.P$4 94.59,6.05 C22.1 91.08,9.5 D26.K
  Bottom 0.178: v65.05,49.98 66.33,48.7 66.33,45.14 66.68,44.8 68.16,44.8 70.18,42.77 70.18,40.12 71.27,39.04 71.27,36.62 74.66,33.23 74.66,21.77 76.56,19.88 81.25,19.88 88.81,12.32 v88.81,8.65
GND
  Top 0.406: C4.2 122.87,16.27 122.87,17.61 120.61,19.87 FB2.2
  Top 0.508: FB3.1 117.62,22.62 arc-45 119.42,21.88 FB2.2 | FB4.1 arc45 115.79,20.96 120.34,20.96 FB2.2 | FB7.1 118.22,19.34 arc45 120.02,20.09 FB2.2
  Top 0.813: C15.2 116.27,24.89 C12.2 118.45,22.85 FB2.2 120.47,20.68 C15.2 | C15.2 116.25,23.14 FB3.1 FB7.1
GND_USB
  Top 0.508: 125.35,20.25 USB-C.A1/B12 122.39,20.65 122.77,20.27 arc45 124.57,19.53 | 125.25,27.78 arc45 USB-C.B1/A12 | D40*1.A 122.55,22.73 C34.2
  pour Top (isolate 0.203): 122.48,28.25 132.19,28.38 132.19,18.38 121.13,18.38
HSE_IN
  Top 0.178: STM32F303VE.12 77.6,55.9 79.02,54.48 Y1.1 81.79,54.48 82.81,55.5 85.12,55.5 C30.1
HSE_OUT
  Top 0.178: STM32F303VE.13 75.47,56.4
  Top 0.203: 75.47,56.4 R21.1
HSE_OUT_
  Top 0.178: R21.2 78.28,56.42 78.28,55.96 78.35,55.89 83.09,55.89 Y1.3 86.04,56.88 C29.1
  Top 0.3: 85.78,57.03 arc-45 C29.1
HSPI_CLK  (via drill 0.5)
  Top 0.254: v52.12,43.05 54.2,43.05 arc-45 SJ10.1
  Bottom 0.254: U1.13 51.11,42.63 arc45 v52.12,43.05
HSPI_CS0